# Altium project NORA_Clock_V0.2.PrjPcb
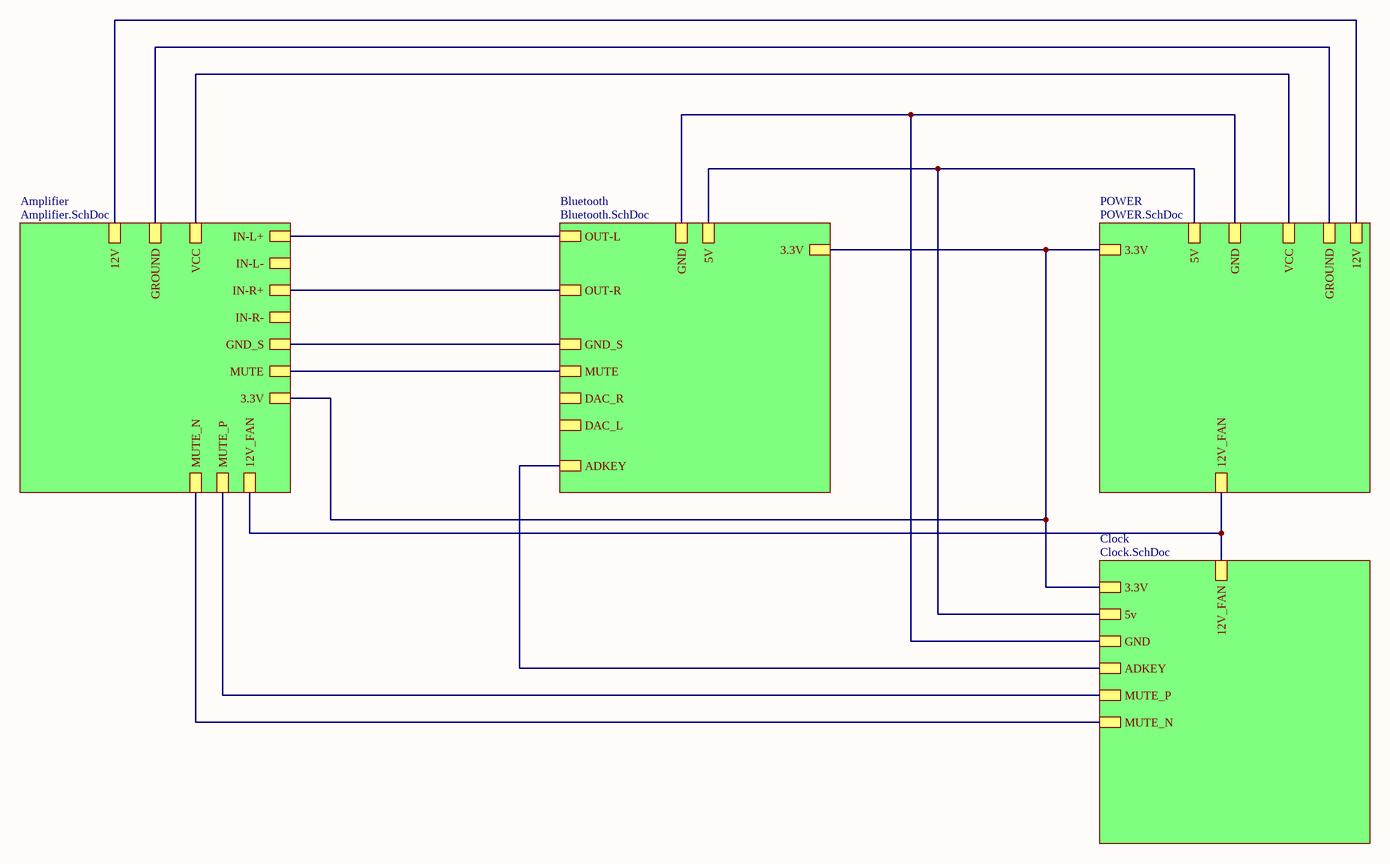
[diagram p0: NORA_Clock_V0.2.SchDoc]
5 sheets, 247 parts. Net scope: hierarchical (ports join the sheet entries above them; power ports are global).
Board files: NORA_Clock_V0.2-Pannel.PcbDoc, NORA_Clock_V0.2.PcbDoc
Sheets:
  NORA_Clock_V0.2.SchDoc
    Amplifier = Amplifier.SchDoc
    Bluetooth = Bluetooth.SchDoc
    POWER = POWER.SchDoc
    Clock = Clock.SchDoc

## Sheet NORA_Clock_V0.2.SchDoc
size A3; Value: 13nH

### Sub-sheets
Amplifier = Amplifier.SchDoc: IN-L+, IN-L-, IN-R+, IN-R-, MUTE, VCC, GROUND, GND_S, 3.3V, 12V, MUTE_P, MUTE_N, 12V_FAN
Bluetooth = Bluetooth.SchDoc: OUT-L, OUT-R, 3.3V, GND_S, GND, 5V, MUTE, DAC_R, DAC_L, ADKEY
Clock = Clock.SchDoc: ADKEY, 3.3V, 5v, GND, MUTE_N, MUTE_P, 12V_FAN
POWER = POWER.SchDoc: 3.3V, GND, 5V, VCC, GROUND, 12V, 12V_FAN

### Nets
3.3V: sheet Amplifier/3.3V, sheet Bluetooth/3.3V, sheet POWER/3.3V, sheet Clock/3.3V
12V: sheet Amplifier/12V, sheet POWER/12V
12V_FAN: sheet Amplifier/12V_FAN, sheet POWER/12V_FAN, sheet Clock/12V_FAN
AGND: sheet Amplifier/GND_S, sheet Bluetooth/GND_S
GND: sheet Amplifier/GROUND, sheet Bluetooth/GND, sheet POWER/GND, sheet POWER/GROUND, sheet Clock/GND
VCC: sheet Amplifier/VCC, sheet POWER/VCC
VPWR: sheet Bluetooth/5V, sheet POWER/5V, sheet Clock/5v
ADKEY: sheet Bluetooth/ADKEY, sheet Clock/ADKEY
CTRL: sheet Amplifier/MUTE_N, sheet Clock/MUTE_N
CTRL_P: sheet Amplifier/MUTE_P, sheet Clock/MUTE_P
DACL: sheet Amplifier/IN-L+, sheet Bluetooth/OUT-L
DACR: sheet Amplifier/IN-R+, sheet Bluetooth/OUT-R
MUTE: sheet Amplifier/MUTE, sheet Bluetooth/MUTE

### Notes on the sheet
- Title
- Size:
- Date:
- A3
- Number:
- Time:
- Revision:
- Sheet
- of
- File:

## Sheet Amplifier.SchDoc
size A2
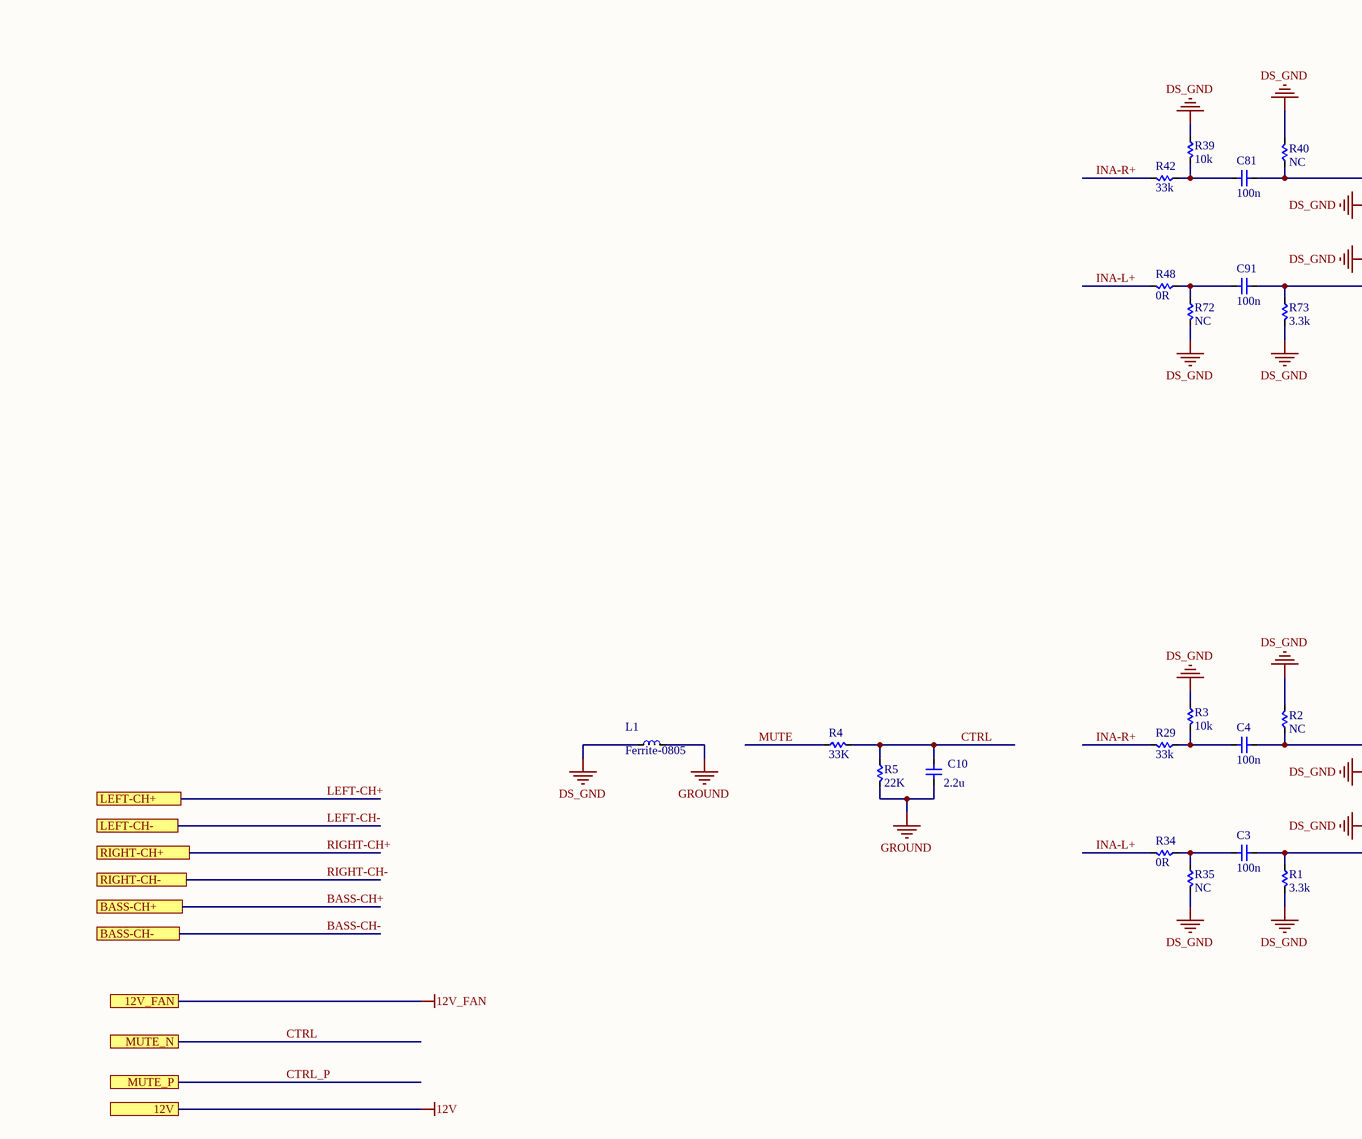
[diagram p1: Amplifier.SchDoc, top left]
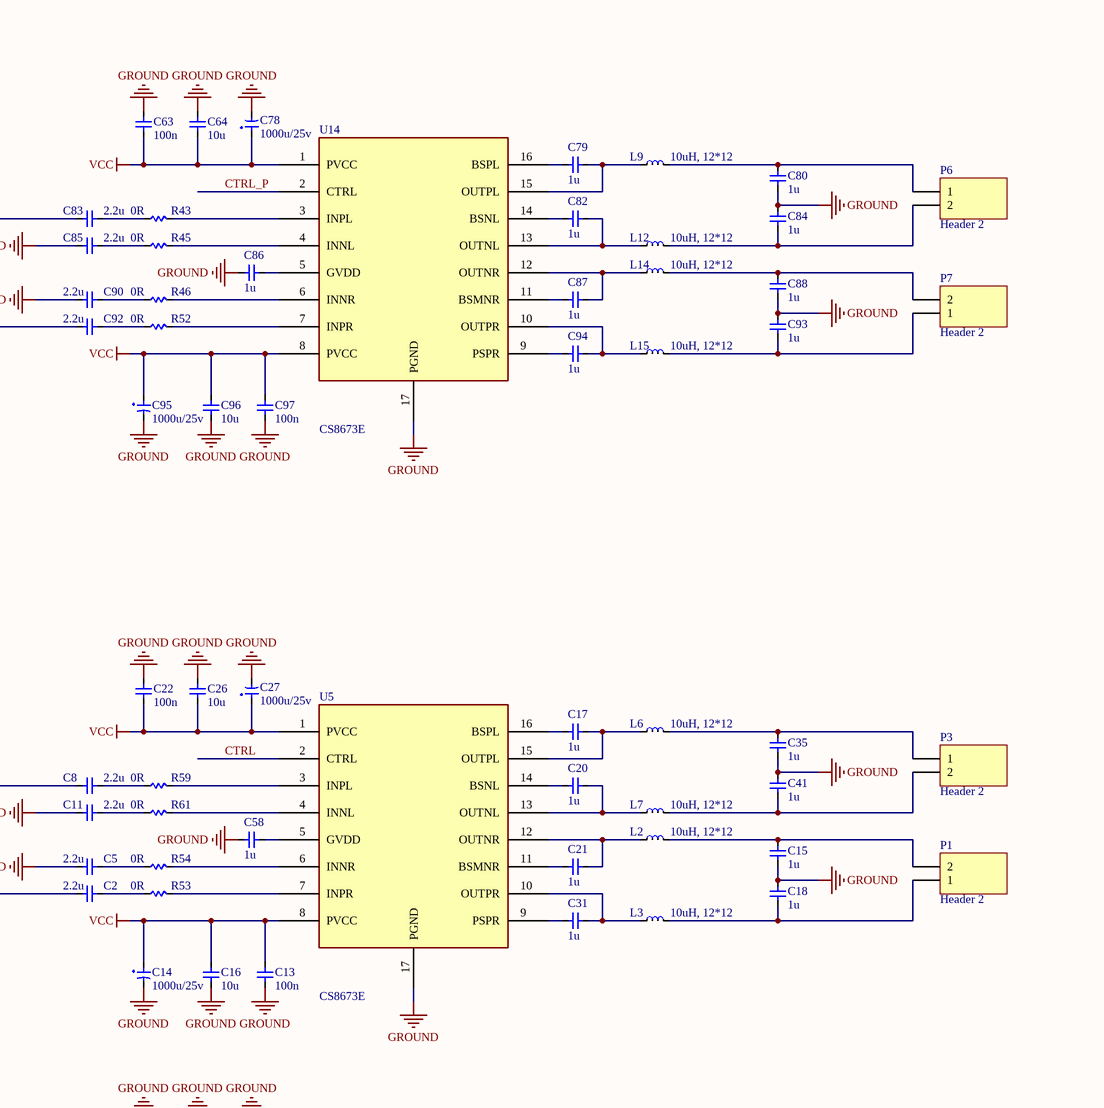
[diagram p2: Amplifier.SchDoc, top right]
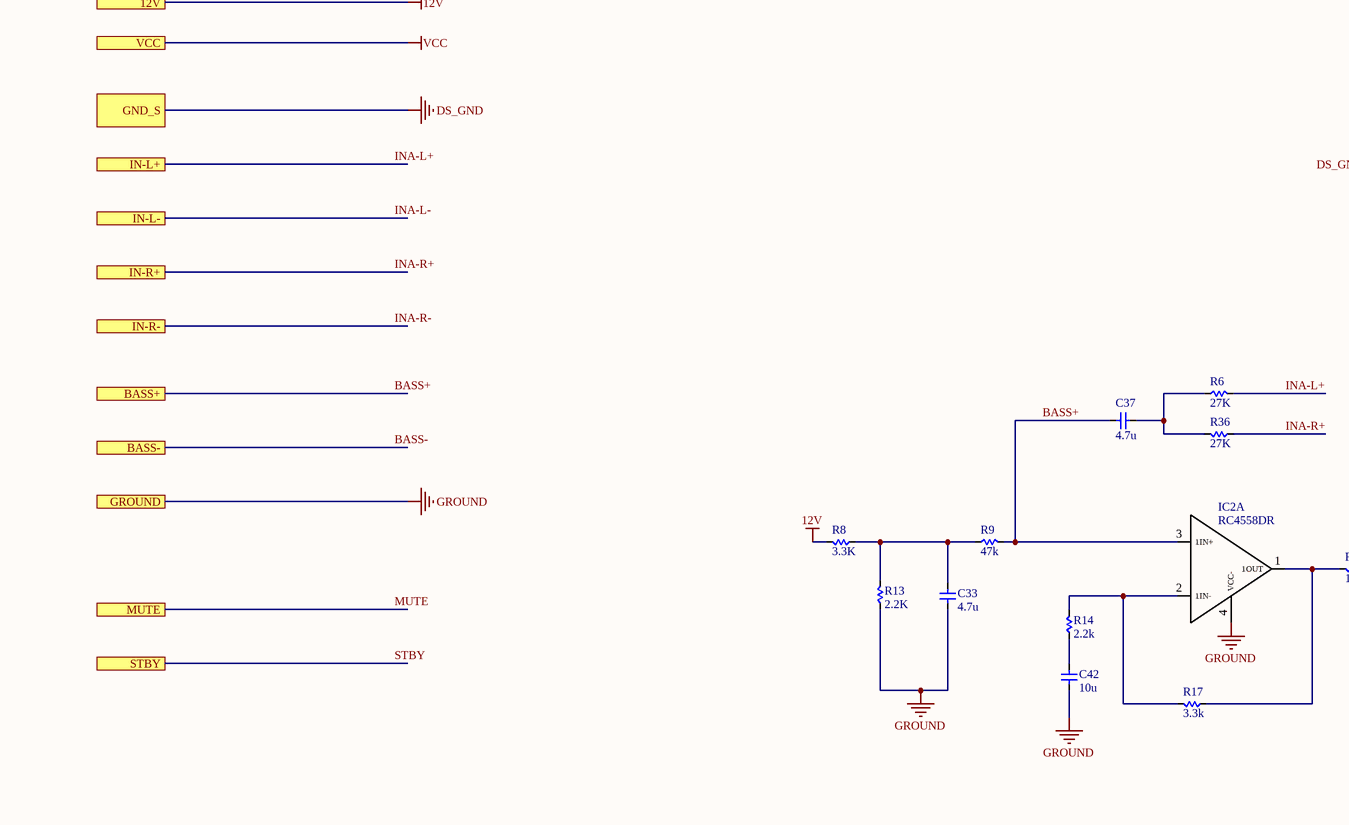
[diagram p3: Amplifier.SchDoc, bottom left]
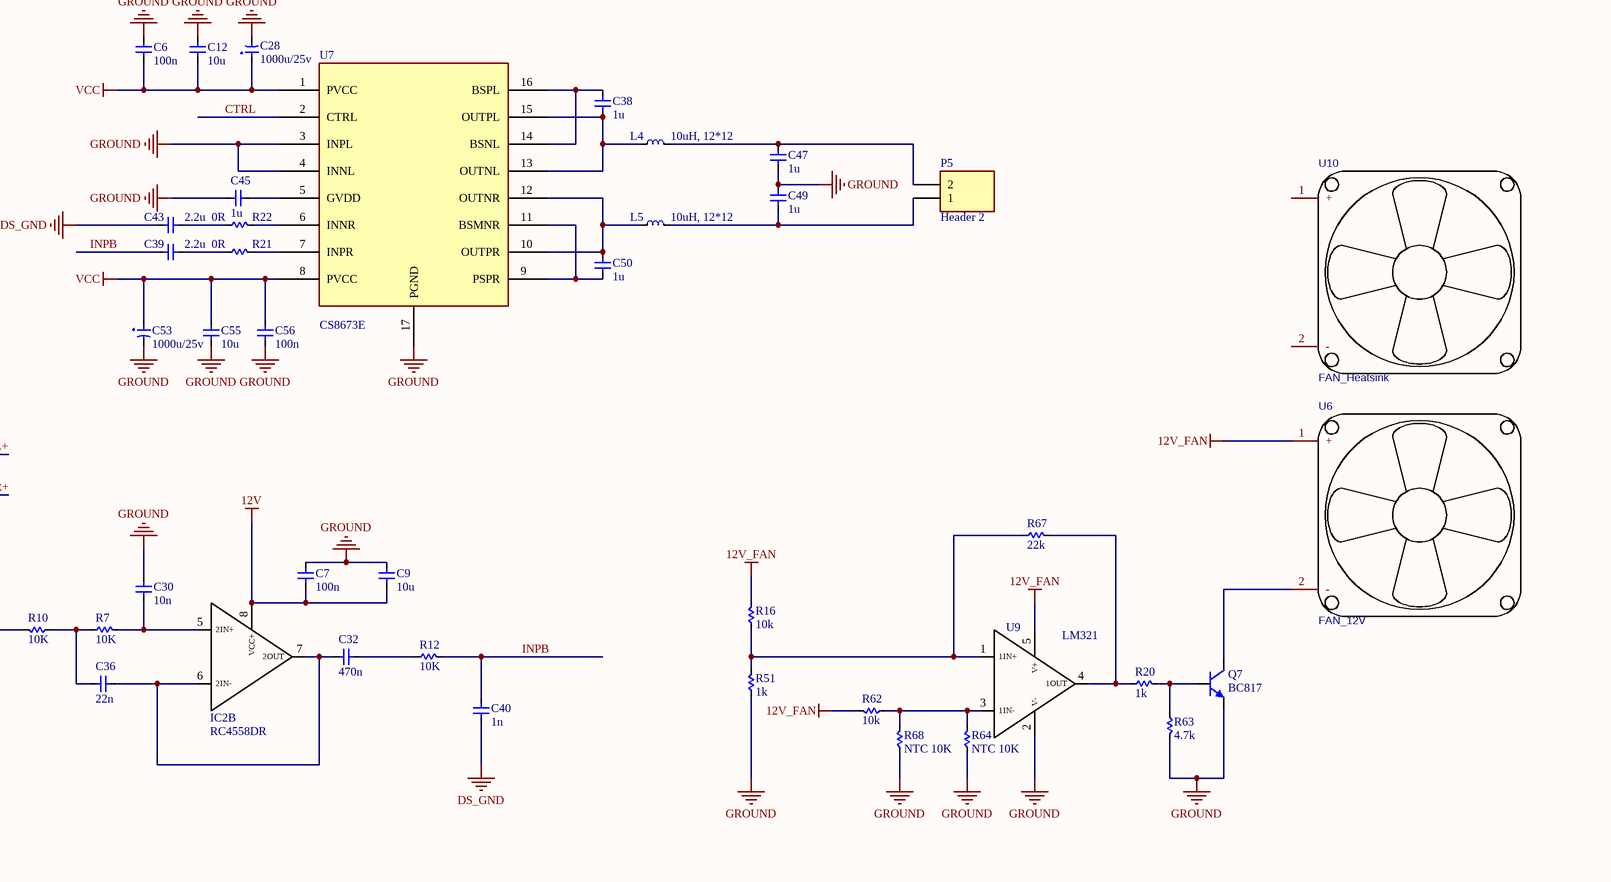
[diagram p4: Amplifier.SchDoc, bottom right]

### Parts
(Parts that share a designator on the sheet are numbered #1, #2 ... from top to bottom, then left to right.)
C2  2.2u  [cap0603]
C3  100n  [cap0603]
C4  100n  [cap0603]
C5  2.2u  [cap0603]
C6  100n  [cap0603]
C7  100n  [cap0603]
C8  2.2u  [cap0603]
C9  10u  [cap0603]
C10  2.2u  [cap0603]
C11  2.2u  [cap0603]
C12  10u  [CAP 0805]
C13  100n  [cap0603]
C14  1000u/25v  [CAP DIP 10*13]
C15  1u  [CAP 0805]
C16  10u  [CAP 0805]
C17  1u  [CAP 0805]
C18  1u  [CAP 0805]
C20  1u  [CAP 0805]
C21  1u  [CAP 0805]
C22  100n  [cap0603]
C26  10u  [CAP 0805]
C27  1000u/25v  [CAP DIP 10*13]
C28  1000u/25v  [CAP DIP 10*13]
C30  10n  [cap0603]
C31  1u  [CAP 0805]
C32  470n  [cap0603]
C33  4.7u  [cap0603]
C35  1u  [CAP 0805]
C36  22n  [cap0603]
C37  4.7u  [cap0603]
C38  1u  [CAP 0805]
C39  2.2u  [cap0603]
C40  1n  [cap0603]
C41  1u  [CAP 0805]
C42  10u  [CAP 1206]
C43  2.2u  [cap0603]
C45  1u  [cap0603]
C47  1u  [CAP 0805]
C49  1u  [CAP 0805]
C50  1u  [CAP 0805]
C53  1000u/25v  [CAP DIP 10*13]
C55  10u  [CAP 0805]
C56  100n  [cap0603]
C58  1u  [cap0603]
C63  100n  [cap0603]
C64#1  10u  [CAP 0805]
C78  1000u/25v  [CAP DIP 10*13]
C79  1u  [CAP 0805]
C80  1u  [CAP 0805]
C81  100n  [cap0603]
C82  1u  [CAP 0805]
C83  2.2u  [cap0603]
C84  1u  [CAP 0805]
C85  2.2u  [cap0603]
C86  1u  [cap0603]
C87  1u  [CAP 0805]
C88  1u  [CAP 0805]
C90  2.2u  [cap0603]
C91  100n  [cap0603]
C92  2.2u  [cap0603]
C93  1u  [CAP 0805]
C94  1u  [CAP 0805]
C95  1000u/25v  [CAP DIP 10*13]
C96  10u  [CAP 0805]
C97  100n  [cap0603]
IC2  RC4558DR  [RC4558]  (parts A,B of 2)
L1  Ferrite-0805  [Ferrite-0805]
L2  10uH, 12*12  [inductor 12*12]
L3  10uH, 12*12  [inductor 12*12]
L4  10uH, 12*12  [inductor 12*12]
L5  10uH, 12*12  [inductor 12*12]
L6  10uH, 12*12  [inductor 12*12]
L7  10uH, 12*12  [inductor 12*12]
L9  10uH, 12*12  [inductor 12*12]
L12  10uH, 12*12  [inductor 12*12]
L14  10uH, 12*12  [inductor 12*12]
L15  10uH, 12*12  [inductor 12*12]
P1  Header 2  [CONN-PHOENIX-5.08]
P3  Header 2  [CONN-PHOENIX-5.08]
P5  Header 2  [CONN-PHOENIX-3.81]
P6  Header 2  [CONN-PHOENIX-5.08]
P7  Header 2  [CONN-PHOENIX-5.08]
Q7  BC817  [BC817]
R1  3.3k  [RES-0603]
R2  NC  [RES-0603]
R3  10k  [RES-0603]
R4  33K  [RES-0603]
R5  22K  [RES-0603]
R6  27K  [RES-0603]
R7  10K  [RES-0603]
R8  3.3K  [RES-0603]
R9  47k  [RES-0603]
R10  10K  [RES-0603]
R12  10K  [RES-0603]
R13  2.2K  [RES-0603]
R14  2.2k  [RES-0603]
R16  10k  [RES-0603]
R17  3.3k  [RES-0603]
R20  1k  [RES-0603]
R21  0R  [RES-0603]
R22  0R  [RES-0603]
R29  33k  [RES-0603]
R34  0R  [RES-0603]
R35  NC  [RES-0603]
R36  27K  [RES-0603]
R39  10k  [RES-0603]
R40  NC  [RES-0603]
R42  33k  [RES-0603]
R43  0R  [RES-0603]
R45  0R  [RES-0603]
R46  0R  [RES-0603]
R48  0R  [RES-0603]
R51  1k  [RES-0603]
R52  0R  [RES-0603]
R53  0R  [RES-0603]
R54  0R  [RES-0603]
R59  0R  [RES-0603]
R61  0R  [RES-0603]
R62  10k  [RES-0603]
R63  4.7k  [RES-0603]
R64  NTC 10K  [RES-0805]
R67  22k  [RES-0603]
R68  NTC 10K  [RES-0805]
R72  NC  [RES-0603]
R73  3.3k  [RES-0603]
U5  CS8673E  [CS8673E]
U6  FAN_12V  [FAN_Connector XH]
U7  CS8673E  [CS8673E]
U9  LM321  [LM321]
U10  FAN_Heatsink  [FAN_Heatsink]
U14  CS8673E  [CS8673E]

### Ports
12V, 12V_FAN, BASS+, BASS-, BASS-CH+, BASS-CH-, GND_S, GROUND, IN-L+, IN-L-, IN-R+, IN-R-, LEFT-CH+, LEFT-CH-, MUTE, MUTE_N, MUTE_P, RIGHT-CH+, RIGHT-CH-, STBY, VCC

### Nets
12V: C7.2 C9.1 IC2.8(VCC+) R8.2 ; port 12V
12V_FAN: R16.2 R62.2 U6.1(+) U9.5(V+) ; port 12V_FAN
DS_GND: C5.2 C11.2 C40.1 C43.2 C85.2 C90.2 L1.2 R1.2 R2.2 R3.1 R35.2 R39.1 R40.2 R72.2 R73.2 ; port GND_S  [project net AGND]
GROUND: C6.2 C7.1 C9.2 C10.1 C12.1 C13.2 C14.2(NEG) C15.1 C16.1 C18.2 C22.2 C26.1 C27.2(NEG) C28.2(NEG) C30.1 C33.1 C35.1 C41.2 C42.1 C45.1 C47.1 C49.2 C53.2(NEG) C55.1 C56.2 C58.1 C63.2 C64#1.1 C78.2(NEG) C80.1 C84.2 C86.1 C88.1 C93.2 C95.2(NEG) C96.1 C97.2 IC2.4(VCC-) L1.1 Q7.2(E) R5.2 R13.1 R51.1 R63.2 R64.1 R68.1 U5.17(PGND) U7.3(INPL) U7.4(INNL) U7.17(PGND) U9.2(V-) U14.17(PGND) ; port GROUND  [project net GND]
VCC: C6.1 C12.2 C13.1 C14.1(POS) C16.2 C22.1 C26.2 C27.1(POS) C28.1(POS) C53.1(POS) C55.2 C56.1 C63.1 C64#1.2 C78.1(POS) C95.1(POS) C96.2 C97.1 U5.1(PVCC) U5.8(PVCC) U7.1(PVCC) U7.8(PVCC) U14.1(PVCC) U14.8(PVCC) ; port VCC
BASS+: C37.1 IC2.3(1IN+) R9.2 ; port BASS+
BASS-: port BASS-
BASS-CH+: port BASS-CH+
BASS-CH-: port BASS-CH-
CTRL: C10.2 R4.2 R5.1 U5.2(CTRL) U7.2(CTRL) ; port MUTE_N
CTRL_P: U14.2(CTRL) ; port MUTE_P
INA-L+: R6.2 R34.2 R48.2 ; port IN-L+  [project net DACL]
INA-L-: port IN-L-
INA-R+: R29.2 R36.1 R42.2 ; port IN-R+  [project net DACR]
INA-R-: port IN-R-
INPB: C39.2 C40.2 R12.2
LEFT-CH+: port LEFT-CH+
LEFT-CH-: port LEFT-CH-
MUTE: R4.1 ; port MUTE
RIGHT-CH+: port RIGHT-CH+
RIGHT-CH-: port RIGHT-CH-
STBY: port STBY
NetC2_1: C2.1 C3.1 R1.1
NetC2_2: C2.2 R53.1
NetC3_2: C3.2 R34.1 R35.1
NetC4_1: C4.1 C8.2 R2.1
NetC4_2: C4.2 R3.2 R29.1
NetC5_1: C5.1 R54.1
NetC8_1: C8.1 R59.1
NetC11_1: C11.1 R61.1
NetC15_2: C15.2 L2.1 P1.2
NetC17_1: C17.1 L6.2 U5.15(OUTPL)
NetC17_2: C17.2 U5.16(BSPL)
NetC18_1: C18.1 L3.1 P1.1
NetC20_1: C20.1 L7.2 U5.13(OUTNL)
NetC20_2: C20.2 U5.14(BSNL)
NetC21_1: C21.1 L2.2 U5.12(OUTNR)
NetC21_2: C21.2 U5.11(BSMNR)
NetC30_2: C30.2 IC2.5(2IN+) R7.2
NetC31_1: C31.1 L3.2 U5.10(OUTPR)
NetC31_2: C31.2 U5.9(PSPR)
NetC32_1: C32.1 C36.1 IC2.6(2IN-) IC2.7(2OUT)
NetC32_2: C32.2 R12.1
NetC33_2: C33.2 R8.1 R9.1 R13.2
NetC35_2: C35.2 L6.1 P3.1
NetC36_2: C36.2 R7.1 R10.1
NetC37_2: C37.2 R6.1 R36.2
NetC38_1: C38.1 L4.2 U7.13(OUTNL) U7.15(OUTPL)
NetC38_2: C38.2 U7.14(BSNL) U7.16(BSPL)
NetC39_1: C39.1 R21.1
NetC41_1: C41.1 L7.1 P3.2
NetC42_2: C42.2 R14.1
NetC43_1: C43.1 R22.1
NetC45_2: C45.2 U7.5(GVDD)
NetC47_2: C47.2 L4.1 P5.2
NetC49_1: C49.1 L5.1 P5.1
NetC50_1: C50.1 L5.2 U7.10(OUTPR) U7.12(OUTNR)
NetC50_2: C50.2 U7.9(PSPR) U7.11(BSMNR)
NetC58_2: C58.2 U5.5(GVDD)
NetC79_1: C79.1 L9.2 U14.15(OUTPL)
NetC79_2: C79.2 U14.16(BSPL)
NetC80_2: C80.2 L9.1 P6.1
NetC81_1: C81.1 C83.2 R40.1
NetC81_2: C81.2 R39.2 R42.1
NetC82_1: C82.1 L12.2 U14.13(OUTNL)
NetC82_2: C82.2 U14.14(BSNL)
NetC83_1: C83.1 R43.1
NetC84_1: C84.1 L12.1 P6.2
NetC85_1: C85.1 R45.1
NetC86_2: C86.2 U14.5(GVDD)
NetC87_1: C87.1 L14.2 U14.12(OUTNR)
NetC87_2: C87.2 U14.11(BSMNR)
NetC88_2: C88.2 L14.1 P7.2
NetC90_1: C90.1 R46.1
NetC91_1: C91.1 C92.1 R73.1
NetC91_2: C91.2 R48.1 R72.1
NetC92_2: C92.2 R52.1
NetC93_1: C93.1 L15.1 P7.1
NetC94_1: C94.1 L15.2 U14.10(OUTPR)
NetC94_2: C94.2 U14.9(PSPR)
NetIC2_1: IC2.1(1OUT) R10.2 R17.1
NetIC2_2: IC2.2(1IN-) R14.2 R17.2
NetQ7_1: Q7.1(B) R20.2 R63.1
NetQ7_3: Q7.3(C) U6.2(-)
NetR16_1: R16.1 R51.2 R67.1 U9.1(1IN+)
NetR20_1: R20.1 R67.2 U9.4(1OUT)
NetR21_2: R21.2 U7.7(INPR)
NetR22_2: R22.2 U7.6(INNR)
NetR43_2: R43.2 U14.3(INPL)
NetR45_2: R45.2 U14.4(INNL)
NetR46_2: R46.2 U14.6(INNR)
NetR52_2: R52.2 U14.7(INPR)
NetR53_2: R53.2 U5.7(INPR)
NetR54_2: R54.2 U5.6(INNR)
NetR59_2: R59.2 U5.3(INPL)
NetR61_2: R61.2 U5.4(INNL)
NetR62_1: R62.1 R64.2 R68.2 U9.3(1IN-)

Not connected (* = marked no-connect by the designer): U10 1(+) 2(-)

### Notes on the sheet
- Title
- Size:
- Date:
- File:
- A1
- Number:
- Time:
- Revision:
- Sheet
- of

### Library data of the parts
C2 C5-C8 C11 C13 C22 C30 C32 C36 C39 C40 C43 C45 C56 C58 C63 C83 C85 C86 C90 C92 C97 = Cap 0603: Capacitor 0603; Published: 8-Jun-2000; LatestRevisionDate: 17-Jul-2002; LatestRevisionNote: Re-released for DXP Platform.; Publisher: Altium Limited; Value: *
C3 C4 C9 C10 C33 C37 C81 C91 = Cap 0603: Capacitor 0603; Value: 104; Published: 8-Jun-2000; LatestRevisionDate: 17-Jul-2002; LatestRevisionNote: Re-released for DXP Platform.; Publisher: Altium Limited
C12 C15-C18 C20 C21 C26 C31 C35 C38 C41 C47 C49 C50 C55 C64#1 C79 C80 C82 C84 C87 C88 C93 C94 C96 = Cap 0805: Capacitor 0805; Value: 104; Published: 8-Jun-2000; LatestRevisionDate: 17-Jul-2002; LatestRevisionNote: Re-released for DXP Platform.; Publisher: Altium Limited
C14 C27 C28 C53 C78 C95 = capacitor dip 10*13: 2200ÂµF 50V Aluminum Electrolytic Capacitors Radial, Can 1000 Hrs @ 105Â°C; MF: Nichicon; MP: UVZ1H222MHD; Package: Radial Nichicon; Value: *; Price: None; SnapEDA_Link: https://www.snapeda.com/parts/UVZ1H222MHD/Nichicon/view-part/468437/?ref=snap; Availability: Unavailable
C42 = Cap 1206: Capacitor 1206; Value: 104; Published: 8-Jun-2000; LatestRevisionDate: 17-Jul-2002; LatestRevisionNote: Re-released for DXP Platform.; Publisher: Altium Limited
IC2 = RC4558DR: Integrated Circuit SOIC 8; Manufacturer_Name: Texas Instruments; Datasheet Link: http://www.ti.com/lit/gpn/rc4558; Height: 1.75mm; Manufacturer_Part_Number: RC4558DR; Arrow Part Number: RC4558DR; Arrow Price/Stock: https://www.arrow.com/en/products/rc4558dr/texas-instruments; Mouser Part Number: 595-RC4558DR; Mouser Price/Stock: https://www.mouser.co.uk/ProductDetail/Texas-Instruments/RC4558DR?qs=DXdcjUGny5OhrzskaZRdew%3D%3D
L1 = Ferrite _0805: BLM Series 0805 330 Ohm 400 mA 0.58 Ohm DCR Surface Mount Ferrite Bead; MF: Murata; MP: BLM18BB331SN1D; Package: 0603 Murata; Price: None; Availability: Unavailable; SnapEDA_Link: https://www.snapeda.com/parts/BLM18BB331SN1D/Murata%20Electronics%20North%20America/view-part/?ref=snap; Value: *
L2-L7 L9 L12 L14 L15 = INDUCTOR 12*12: Inductor round 12*12; MP: DR127-330-R; MF: Eaton; Price: None; Package: Nonstandard Eaton; Availability: Unavailable; SnapEDA_Link: https://www.snapeda.com/parts/DR127-330-R/Eaton/view-part/?ref=snap; Value: *
P1 P3 P6 P7 = CONN-Phoenix-5.08: Phoenix Connector 5.08; LatestRevisionDate: 17-Jul-2002; LatestRevisionNote: Re-released for DXP Platform.; Publisher: Altium Limited
P5 = CONN-Phoenix-3.81_1: Phoenix Connector 3.81; LatestRevisionDate: 17-Jul-2002; LatestRevisionNote: Re-released for DXP Platform.; Publisher: Altium Limited
Q7 = BC817: NPN General Purpose Amplifier BJT; Published: 8-Jun-2000; LatestRevisionDate: 15-Jan-2003; LatestRevisionNote: PCB Footprint 'BCY-W3/D4.7' replaced; DatasheetVersion: 1997; PackageVersion: Sep-1998; PackageReference: TO-92A; Publisher: Altium Limited; PackageDescription: TO, Flat Index; 3 In-Line, Axial Leads; Body Dia. 4.5mm; Leads 0.51 x 0.48 mm (max); ComponentLink1Description: Manufacturer Link; ComponentLink1URL: http://www.fairchildsemi.com/; ComponentLink2Description: Datasheet; ComponentLink2URL: http://www.fairchildsemi.com/ds/2N%2F2N3904.pdf
R1 R4-R10 R12-R14 R16 R17 R20-R22 R36 R43 R45 R46 R51-R54 R59 R61-R63 R67 R73 = Res 0603: Resistor 0603; Published: 8-Jun-2000; LatestRevisionDate: 29-May-2009; LatestRevisionNote: IPC-7351 Footprint Added.; PackageReference: J1-0603; Publisher: Altium Limited; PackageDescription: Chip Resistor
  R1 R73: Value: 3.3k
  R4-R10 R12-R14 R17 R36: Value: *
R2 R3 R29 R34 R35 R39 R40 R42 R48 R72 = Res 0603: Resistor 0603; Value: 3.3k; Published: 8-Jun-2000; LatestRevisionDate: 29-May-2009; LatestRevisionNote: IPC-7351 Footprint Added.; PackageReference: J1-0603; Publisher: Altium Limited; PackageDescription: Chip Resistor
R64 R68 = Res 0805: resistor 0805
U5 U7 U14 = CS8673E: AB/D 2X40W BTL & 80W PBTL ESOP16; Manufacturer_Name: Chipstar; Manufacturer_Part_Number: CS8679E; Height: 2.47mm; Arrow Part Number: CS8679E; Arrow Price/Stock: https://www.arrow.com/en/products/tda7491hv13tr/stmicroelectronics; Mouser Part Number: 511-TDA7491HV13TR; Mouser Price/Stock: https://www.mouser.com/Search/Refine.aspx?Keyword=511-TDA7491HV13TR
U6 = FAN_12V: FAN 12V 40*40*10mm . XH Connector; Contributor: novasilisko; timeStamp: 1467237407; Manufacturer Part: ?; spicePre: U
U9 = LM321: Operational Amplifier 5-SOT-23; MP: OPA354AIDBVT; MF: Texas Instruments; Package: SOT-23-5 Texas Instruments; Digi-Key_Purchase_URL: https://www.digikey.de/product-detail/en/texas-instruments/OPA354AIDBVT/296-13033-1-ND/480149?utm_source=snapeda&utm_medium=aggregator&utm_campaign=symbol; SnapEDA_Link: https://www.snapeda.com/parts/OPA354AIDBVT/Texas%20Instruments/view-part/?ref=snap; Digi-Key_Part_Number: 296-13033-1-ND; Value: *
U10 = FAN_Heatsink: 55mm Aluminum Heatsink with Cooling Fan; Contributor: novasilisko; timeStamp: 1467237407; Manufacturer Part: ?; spicePre: U

## Sheet Bluetooth.SchDoc
size A3 portrait
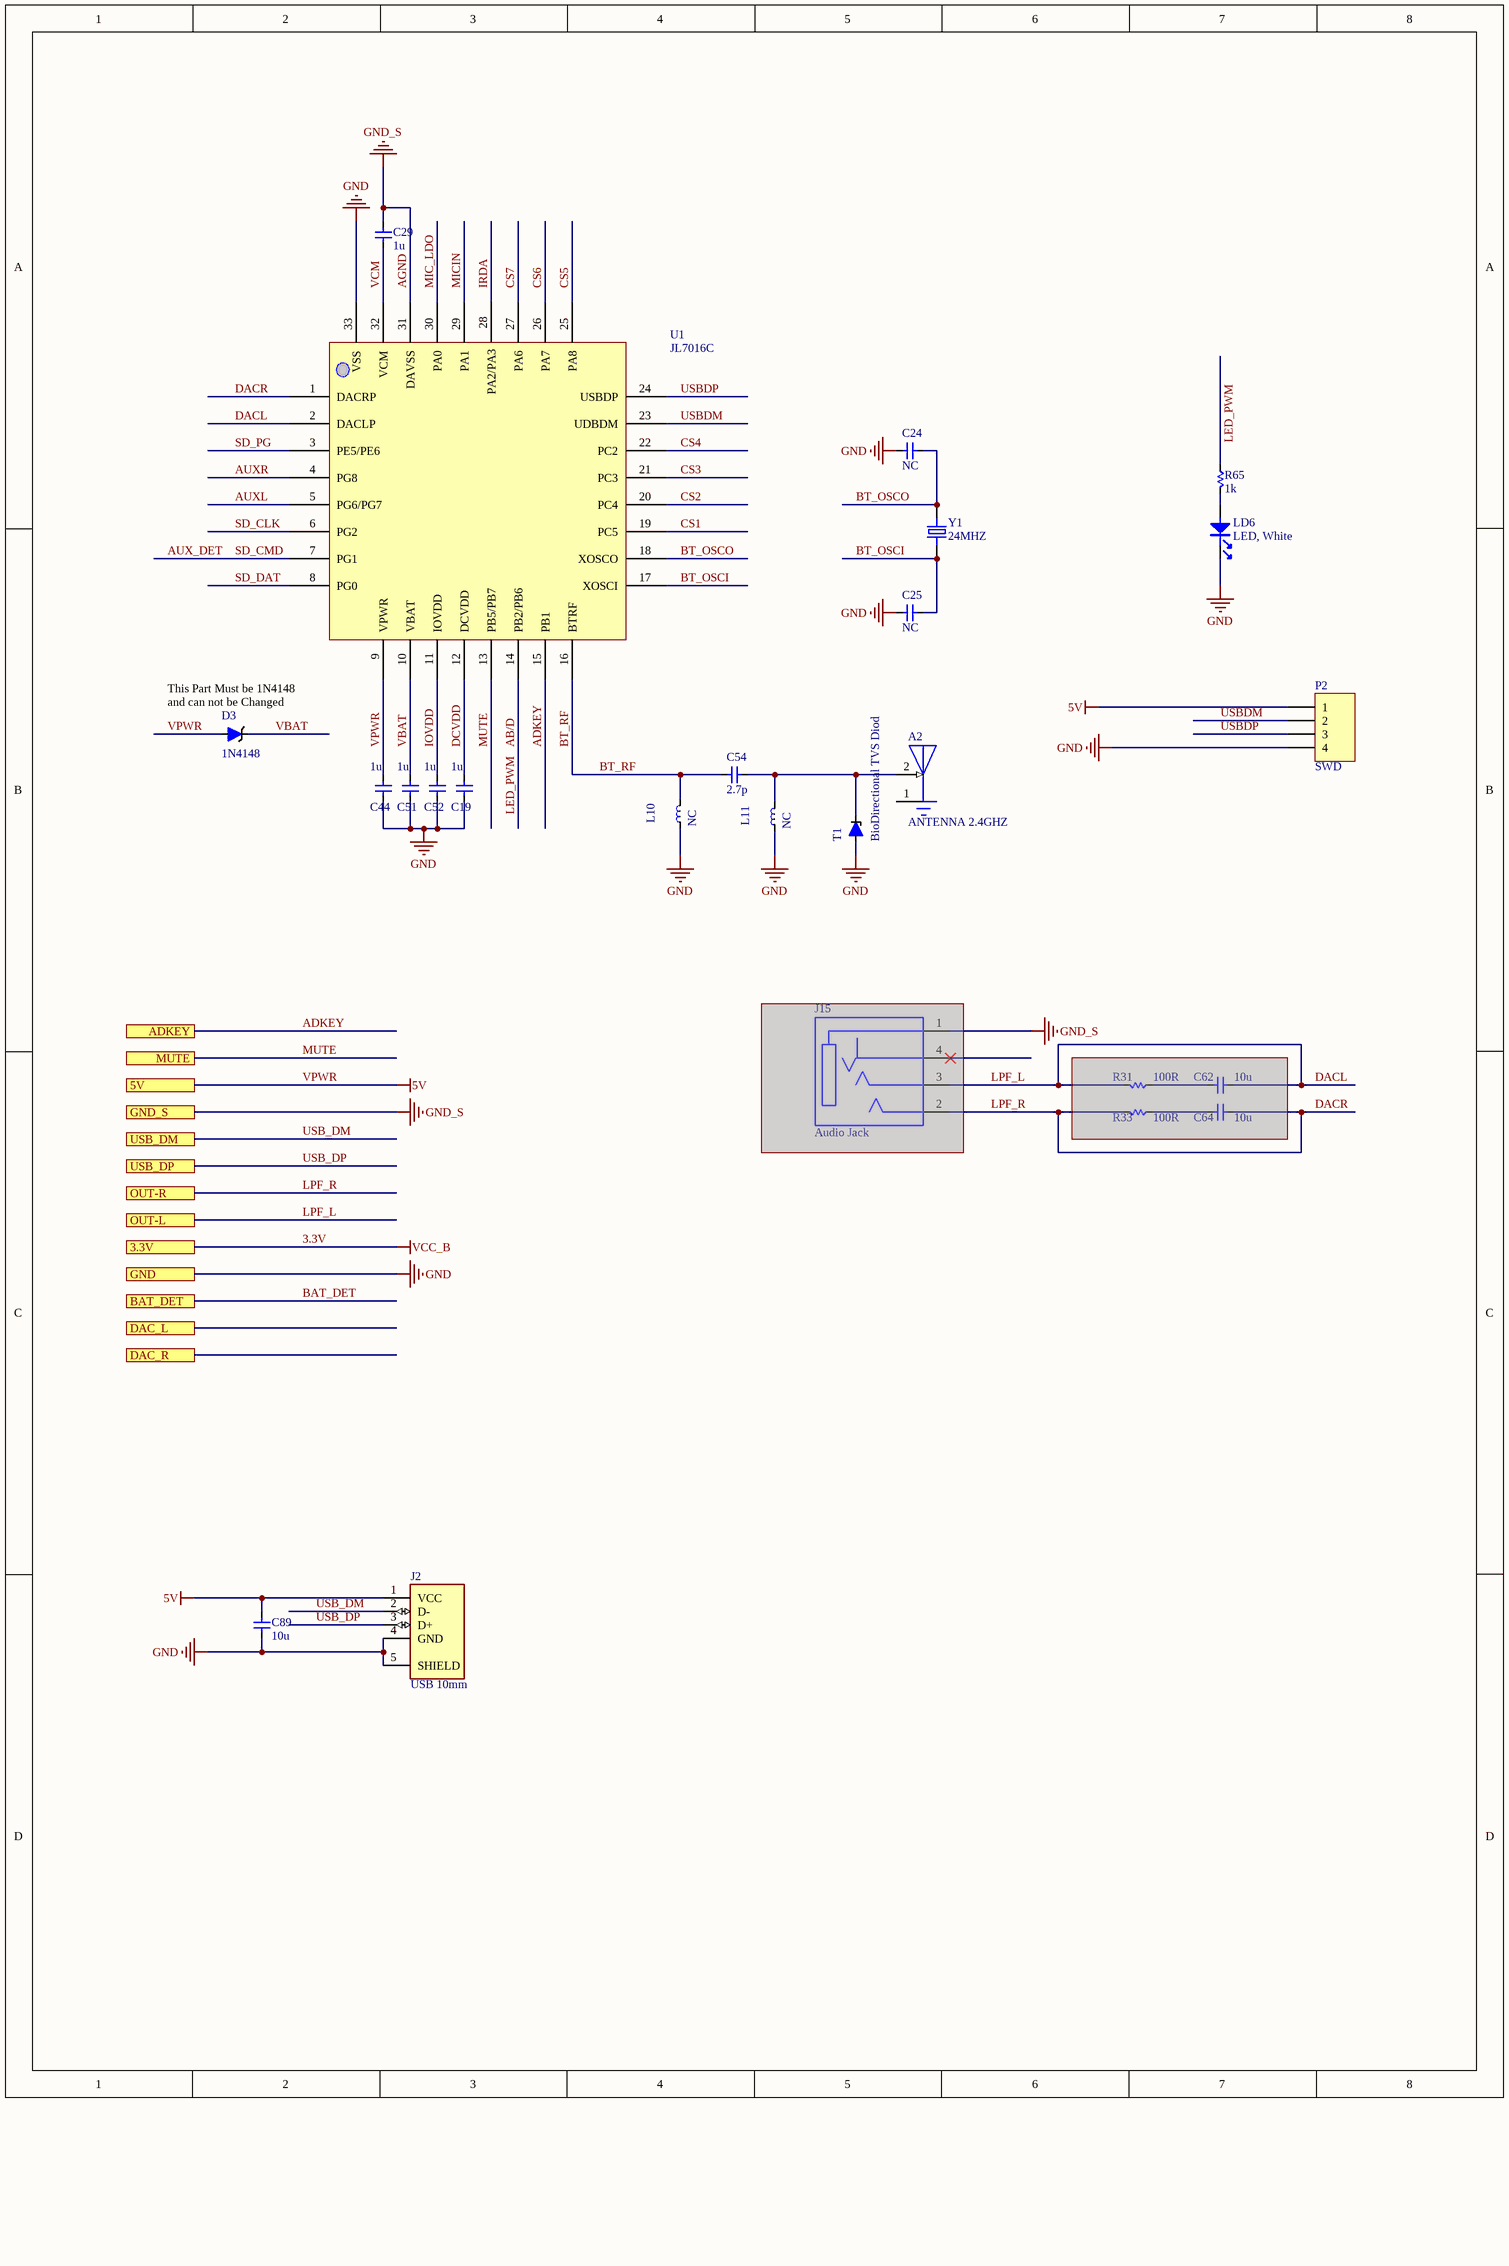
[diagram p5: Bluetooth.SchDoc]

### Parts
(Parts that share a designator on the sheet are numbered #1, #2 ... from top to bottom, then left to right.)
A2  ANTENNA 2.4GHZ  [ANTENNA 2.4GHZ - TI]
C19  1u  [cap0603]
C24  NC  [cap0603]
C25  NC  [cap0603]
C29  1u  [cap0603]
C44  1u  [cap0603]
C51  1u  [cap0603]
C52  1u  [cap0603]
C54  2.7p  [cap0603]
C62#1  10u  [CAP 0805]  (masked out: inside a compile mask, not in the netlist)
C64#2  10u  [CAP 0805]  (masked out: inside a compile mask, not in the netlist)
C89  10u  [CAP 0805]
D3  1N4148  [1N4148 SOD-123]
J2  USB 10mm  [USB SMALL]
J15  Audio Jack  [Audio jack_ CUI_SJ2-3574A-SMT-TR]  (masked out: inside a compile mask, not in the netlist)
L10  NC  [inductor 0603]
L11  NC  [inductor 0603]
LD6  LED, White  [LED-0603-BLUE]
P2  SWD  [HDR1X4H]
R31#1  100R  [RES-0603]  (masked out: inside a compile mask, not in the netlist)
R33#1  100R  [RES-0603]  (masked out: inside a compile mask, not in the netlist)
R65  1k  [RES-0603]
T1  BioDirectional TVS Diod  [SMAJ3.3A]
U1  JL7016C  [JL7016C]
Y1  24MHZ  [crystal b]

### Ports
3.3V, 5V, ADKEY, BAT_DET, DAC_L, DAC_R, GND, GND_S, MUTE, OUT-L, OUT-R, USB_DM, USB_DP

### Nets
AGND: C29.2 U1.31(DAVSS) ; port GND_S  [also labelled GND_S]
GND: C19.2 C24.1 C25.2 C44.2 C51.2 C52.2 C89.1 J2.4(GND) J2.5(SHIELD) L10.2 L11.2 LD6.1 P2.4 T1.A U1.33(VSS) ; port GND
VPWR: C44.1 C89.2 D3.1(A) J2.1(VCC) P2.1 U1.9(VPWR) ; port 5V  [also labelled 5V]
AB/D: R65.1 U1.14(PB2/PB6)  [also labelled LED_PWM]
ADKEY: U1.15(PB1) ; port ADKEY
AUX_DET: U1.7(PG1)  [also labelled SD_CMD]
AUXL: U1.5(PG6/PG7)
AUXR: U1.4(PG8)
BAT_DET: port BAT_DET
BT_OSCI: C25.1 U1.17(XOSCI) Y1.1
BT_OSCO: C24.2 U1.18(XOSCO) Y1.2
BT_RF: C54.2 L10.1 U1.16(BTRF)
CS1: U1.19(PC5)
CS2: U1.20(PC4)
CS3: U1.21(PC3)
CS4: U1.22(PC2)
CS5: U1.25(PA8)
CS6: U1.26(PA7)
CS7: U1.27(PA6)
DACL: U1.2(DACLP) ; port OUT-L  [also labelled LPF_L]
DACR: U1.1(DACRP) ; port OUT-R  [also labelled LPF_R]
DCVDD: C19.1 U1.12(DCVDD)
IOVDD: C52.1 U1.11(IOVDD)
IRDA: U1.28(PA2/PA3)
MIC_LDO: U1.30(PA0)
MICIN: U1.29(PA1)
MUTE: U1.13(PB5/PB7) ; port MUTE
SD_CLK: U1.6(PG2)
SD_DAT: U1.8(PG0)
SD_PG: U1.3(PE5/PE6)
USB_DM: J2.2(D-) ; port USB_DM
USB_DP: J2.3(D+) ; port USB_DP
USBDM: P2.2 U1.23(UDBDM)
USBDP: P2.3 U1.24(USBDP)
VBAT: C51.1 D3.2(C) U1.10(VBAT)
VCM: C29.1 U1.32(VCM)
NetA2_2: A2.2(FEED) C54.1 L11.1 T1.C
NetLD6_2: LD6.2 R65.2

Not connected (* = marked no-connect by the designer): A2 1(GND)

### Notes on the sheet
- (near D3) This Part Must be 1N4148 and can not be Changed
- Title
- Size:
- Date:
- File:
- A2
- Number:
- Time:
- Revision:
- Sheet
- of

### Library data of the parts
A2 = ANTENNA 2.4GHZ: ESP32 ANTENNA; MP: PRO-OB-440; MF: Proant AB; SnapEDA_Link: https://www.snapeda.com/parts/PRO-OB-440/Proant%20AB/view-part/2307534/?ref=snap; Digi-Key_Purchase_URL: https://www.digikey.com/product-detail/en/proant-ab/PRO-OB-440/1532-1001-1-ND/4895684?utm_source=snapeda&utm_medium=aggregator&utm_campaign=symbol; Value: *; Package: None; Digi-Key_Part_Number: 1532-1001-1-ND
C19 C24 C25 C29 C44 C51 C52 C54 = Cap 0603: Capacitor 0603; Value: 104; Published: 8-Jun-2000; LatestRevisionDate: 17-Jul-2002; LatestRevisionNote: Re-released for DXP Platform.; Publisher: Altium Limited
C62#1 C64#2 C89 = Cap 0805: Capacitor 0805; Value: 104; Published: 8-Jun-2000; LatestRevisionDate: 17-Jul-2002; LatestRevisionNote: Re-released for DXP Platform.; Publisher: Altium Limited
D3 = 1N4148_SOD123: SOD-123 Package; MP: EDZV12B; MF: ROHM Semiconductor; Price: None; Package: None; SnapEDA_Link: https://www.snapeda.com/parts/EDZV12B/EMI/view-part/4479349/?ref=snap; Availability: Unavailable; Value: *
J2 = usb a small: UJ2-AV-1-SMT usb a vertical  small; MF: {'manufacturer': u'CUI Devices'}; Package: None; Value: *; Availability: Unavailable; MP: UJ2-AV-1-SMT; Price: None
J15 = Audio Jack _ SJ2-3574A-SMT-TR: 3.5 mm, Stereo, Right Angle, Surface Mount _SMT_, Audio Jack Connector; MF: CUI Devices; Package: None; Value: *; Availability: Unavailable; SnapEDA_Link: https://www.snapeda.com/parts/SJ2-3574A-SMT-TR/CUI%20Devices/view-part/648175/?ref=snap; Price: None; MP: SJ2-3574A-SMT-TR
L10 L11 = INDUCTOR_SMD: Inductor smd; MP: DR127-330-R; MF: Eaton; Price: None; Package: Nonstandard Eaton; Availability: Unavailable; SnapEDA_Link: https://www.snapeda.com/parts/DR127-330-R/Eaton/view-part/?ref=snap; Value: *
LD6 = LED_blue: LED, Blue, 0603; Manuf_1: everlight; Manuf_Part_1: 19-213-R6C-AP1Q2B/3T; ECCN_US/EU: EAR99/NEC; Order: 19-213-R6C-AP1Q2B/3T
P2 = Header 4: Header, 4-Pin; LatestRevisionDate: 17-Jul-2002; LatestRevisionNote: Re-released for DXP Platform.; Publisher: Altium Limited
R31#1 R33#1 R65 = Res 0603: Resistor 0603; Published: 8-Jun-2000; LatestRevisionDate: 29-May-2009; LatestRevisionNote: IPC-7351 Footprint Added.; PackageReference: J1-0603; Publisher: Altium Limited; PackageDescription: Chip Resistor
  R31#1 R33#1: Value: *
T1 = SMAJ3.3A: one side TVS Diode; MP: EDZV12B; MF: ROHM Semiconductor; Price: None; Package: None; SnapEDA_Link: https://www.snapeda.com/parts/EDZV12B/EMI/view-part/4479349/?ref=snap; Availability: Unavailable; Value: *
U1 = JL7016C: BlE Chip
Y1 = crystal b: 13MHz Â±30ppm Crystal 20pF 60 Ohms HC-49/US  ECS-130-20-3X-TR; MF: ECS Inc.; Value: *; SnapEDA_Link: https://www.snapeda.com/parts/ECS-130-20-3X-TR/ECS%20Inc./view-part/2459108/?ref=snap; MP: ECS-130-20-3X-TR; Check_prices: https://www.snapeda.com/parts/ECS-130-20-3X-TR/ECS%20Inc./view-part/2459108/?ref=eda; Purchase-URL: https://pricing.snapeda.com/search/part/ECS-130-20-3X-TR/?ref=eda; Availability: Warning; Price: None; Package: HC49/US ECS International

## Sheet POWER.SchDoc
size A3
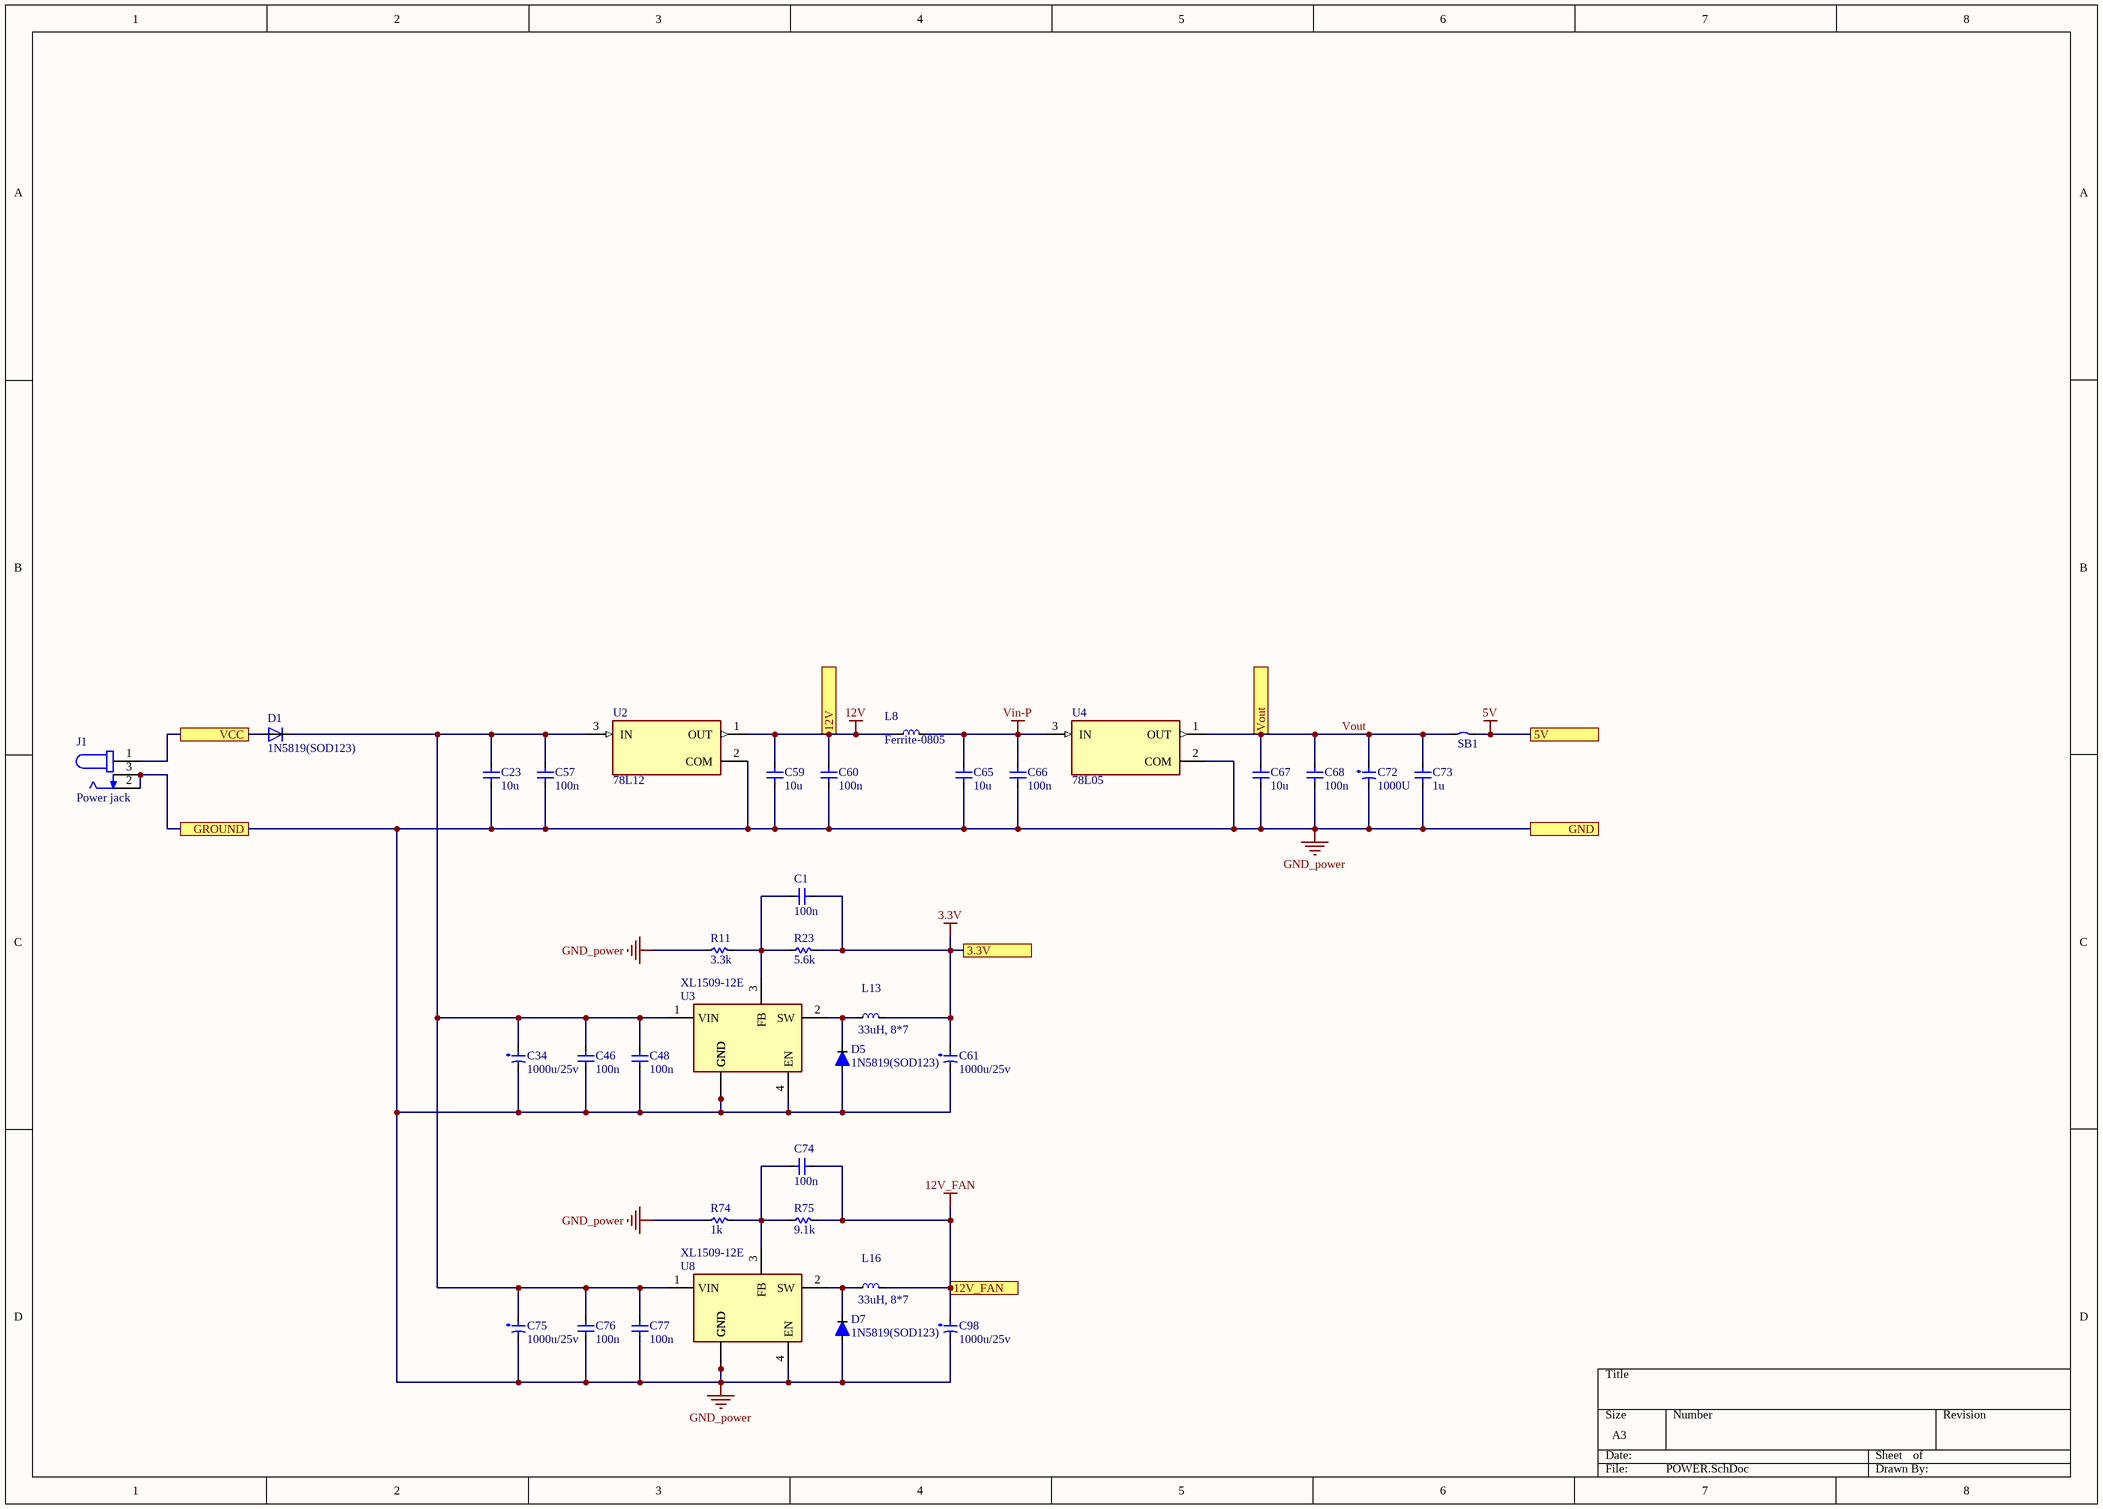
[diagram p6: POWER.SchDoc]

### Parts
C1  100n  [cap0603]
C23  10u  [CAP 0805]
C34  1000u/25v  [CAP DIP 10*13]
C46  100n  [cap0603]
C48  100n  [cap0603]
C57  100n  [cap0603]
C59  10u  [CAP 0805]
C60  100n  [cap0603]
C61  1000u/25v  [CAP DIP 10*13]
C65  10u  [CAP 0805]
C66  100n  [cap0603]
C67  10u  [CAP 0805]
C68  100n  [cap0603]
C72  1000U  [cap  dip 10*20]
C73  1u  [cap0603]
C74  100n  [cap0603]
C75  1000u/25v  [CAP DIP 10*13]
C76  100n  [cap0603]
C77  100n  [cap0603]
C98  1000u/25v  [CAP DIP 10*13]
D1  1N5819(SOD123)  [1N5819 SOD-123]
D5  1N5819(SOD123)  [1N5819 SOD-123]
D7  1N5819(SOD123)  [1N5819 SOD-123]
J1  Power jack  [Power jack]
L8  Ferrite-0805  [Ferrite-0805]
L13  33uH, 8*7  [Inductor 8*7]
L16  33uH, 8*7  [Inductor 8*7]
R11  3.3k  [RES-0603]
R23  5.6k  [RES-0603]
R74  1k  [RES-0603]
R75  9.1k  [RES-0603]
SB1  jumper  [JP2_SMD]  (value not drawn)
U2  78L12  [78L05]
U3  XL1509-12E  [FR9886]
U4  78L05  [78L05]
U8  XL1509-12E  [FR9886]

### Ports
3.3V, 5V, 12V, 12V_FAN, GND, GROUND, VCC, Vout

### Nets
3.3V: C1.1 C61.1(POS) L13.1 R23.2 ; port 3.3V
5V: SB1.2 ; port 5V  [project net VPWR]
12V: C59.2 C60.2 L8.2 U2.1(OUT) ; port 12V
12V_FAN: C74.1 C98.1(POS) L16.1 R75.2 ; port 12V_FAN
GND_power: C23.1 C34.2(NEG) C46.1 C48.1 C57.1 C59.1 C60.1 C61.2(NEG) C65.1 C66.1 C67.1 C68.1 C72.2(NEG) C73.1 C75.2(NEG) C76.1 C77.1 C98.2(NEG) D5.2(C) D7.2(C) J1.2 J1.3 R11.1 R74.1 U2.2(COM) U3.4(EN) U3.5(GND) U3.6(GND) U3.7(GND) U3.8(GND) U4.2(COM) U8.4(EN) U8.5(GND) U8.6(GND) U8.7(GND) U8.8(GND) ; port GROUND, port GND  [project net GND]
VCC: D1.2(A) J1.1 ; port VCC
Vin-P: C65.2 C66.2 L8.1 U4.3(IN)
Vout: C67.2 C68.2 C72.1(POS) C73.2 SB1.1 U4.1(OUT) ; port Vout
NetC1_2: C1.2 R11.2 R23.1 U3.3(FB)
NetC23_2: C23.2 C34.1(POS) C46.2 C48.2 C57.2 C75.1(POS) C76.2 C77.2 D1.1(K) U2.3(IN) U3.1(VIN) U8.1(VIN)
NetC74_2: C74.2 R74.2 R75.1 U8.3(FB)
NetD5_1: D5.1(A) L13.2 U3.2(SW)
NetD7_1: D7.1(A) L16.2 U8.2(SW)

### Library data of the parts
C1 C46 C48 C57 C60 C66 C68 C73 C74 C76 C77 = Cap 0603: Capacitor 0603; Value: 104; Published: 8-Jun-2000; LatestRevisionDate: 17-Jul-2002; LatestRevisionNote: Re-released for DXP Platform.; Publisher: Altium Limited
C23 C59 C65 C67 = Cap 0805: Capacitor 0805; Value: 104; Published: 8-Jun-2000; LatestRevisionDate: 17-Jul-2002; LatestRevisionNote: Re-released for DXP Platform.; Publisher: Altium Limited
C34 C61 C75 C98 = capacitor dip 10*13: as C14 on sheet Amplifier; Package: Radial Nichicon; Value: *; Price: None; SnapEDA_Link: https://www.snapeda.com/parts/UVZ1H222MHD/Nichicon/view-part/468437/?ref=snap; Availability: Unavailable
C72 = capacitor dip 10*20: 2200ÂµF 50V Aluminum Electrolytic Capacitors Radial, Can 1000 Hrs @ 105Â°C; MF: Nichicon; MP: UVZ1H222MHD; Package: Radial Nichicon; Value: *; Price: None; SnapEDA_Link: https://www.snapeda.com/parts/UVZ1H222MHD/Nichicon/view-part/468437/?ref=snap; Availability: Unavailable
D1 D5 D7 = 1N5819(SOD123): Shotkey diod SOD-123; MP: BAS716; MF: Nexperia USA; SnapEDA_Link: https://www.snapeda.com/parts/BAS716/Nexperia%20USA%20Inc./view-part/143287/?ref=snap; Price: None; Package: SOD-523 NXP Semiconductors; Arrow_Electronics-Purchase-URL: https://snapeda.com/shop?store=Arrow+Electronics&id=143287; Value: *; Availability: Unavailable
J1 = Power jack: 2.0 x 6.5 mm, 2.5 A, Horizontal, Through Hole, Tapered Pins, Dc Power Jack Connector; MF: CUI Devices; MP: PJ-102A; CUI_purchase_URL: https://www.cuidevices.com/product/interconnect/connectors/dc-power-connectors/jacks/pj-102a?utm_source=snapeda.com&utm_medium=referral&utm_campaign=snapedaBOM; Price: None; SnapEDA_Link: https://www.snapeda.com/parts/PJ-102A/CUI%20Devices/view-part/55545/?ref=snap; Value: *; Availability: Unavailable; Package: None
L8 = Ferrite _0805: as L1 on sheet Amplifier; Package: 0603 Murata; Price: None; Availability: Unavailable; SnapEDA_Link: https://www.snapeda.com/parts/BLM18BB331SN1D/Murata%20Electronics%20North%20America/view-part/?ref=snap; Value: *
L13 L16 = INDUCTOR 8*7: Inductor round 8*7; MP: DR127-330-R; MF: Eaton; Price: None; Package: Nonstandard Eaton; Availability: Unavailable; SnapEDA_Link: https://www.snapeda.com/parts/DR127-330-R/Eaton/view-part/?ref=snap; Value: *
R11 R23 R74 R75 = Res 0603: Resistor 0603; Published: 8-Jun-2000; LatestRevisionDate: 29-May-2009; LatestRevisionNote: IPC-7351 Footprint Added.; PackageReference: J1-0603; Publisher: Altium Limited; PackageDescription: Chip Resistor
SB1 = jumper: Circuit Breaker; Solder: NO; Revision: July-2002: Re-released for DXP Platform.
U2 U4 = 78L05: Linear Voltage Regulator IC 1 Output 100mA SOT-89-3; MP: UA78L05CPK; MF: Texas Instruments; Availability: Unavailable; Package: SOT-89-3 Texas Instruments; SnapEDA_Link: https://www.snapeda.com/parts/UA78L05CPK/Texas%20Instruments/view-part/512891/?ref=snap; Value: *; Price: None
U3 U8 = XL1509-12E: Regulator SOP-8; Manufacturer_Name: Fitipower; Manufacturer_Part_Number: FR9886SOGTR; Datasheet Link: https://www.insidegadgets.com/wp-content/uploads/2015/03/FR9886.pdf; Height: 1.75mm

## Sheet Clock.SchDoc
size A2
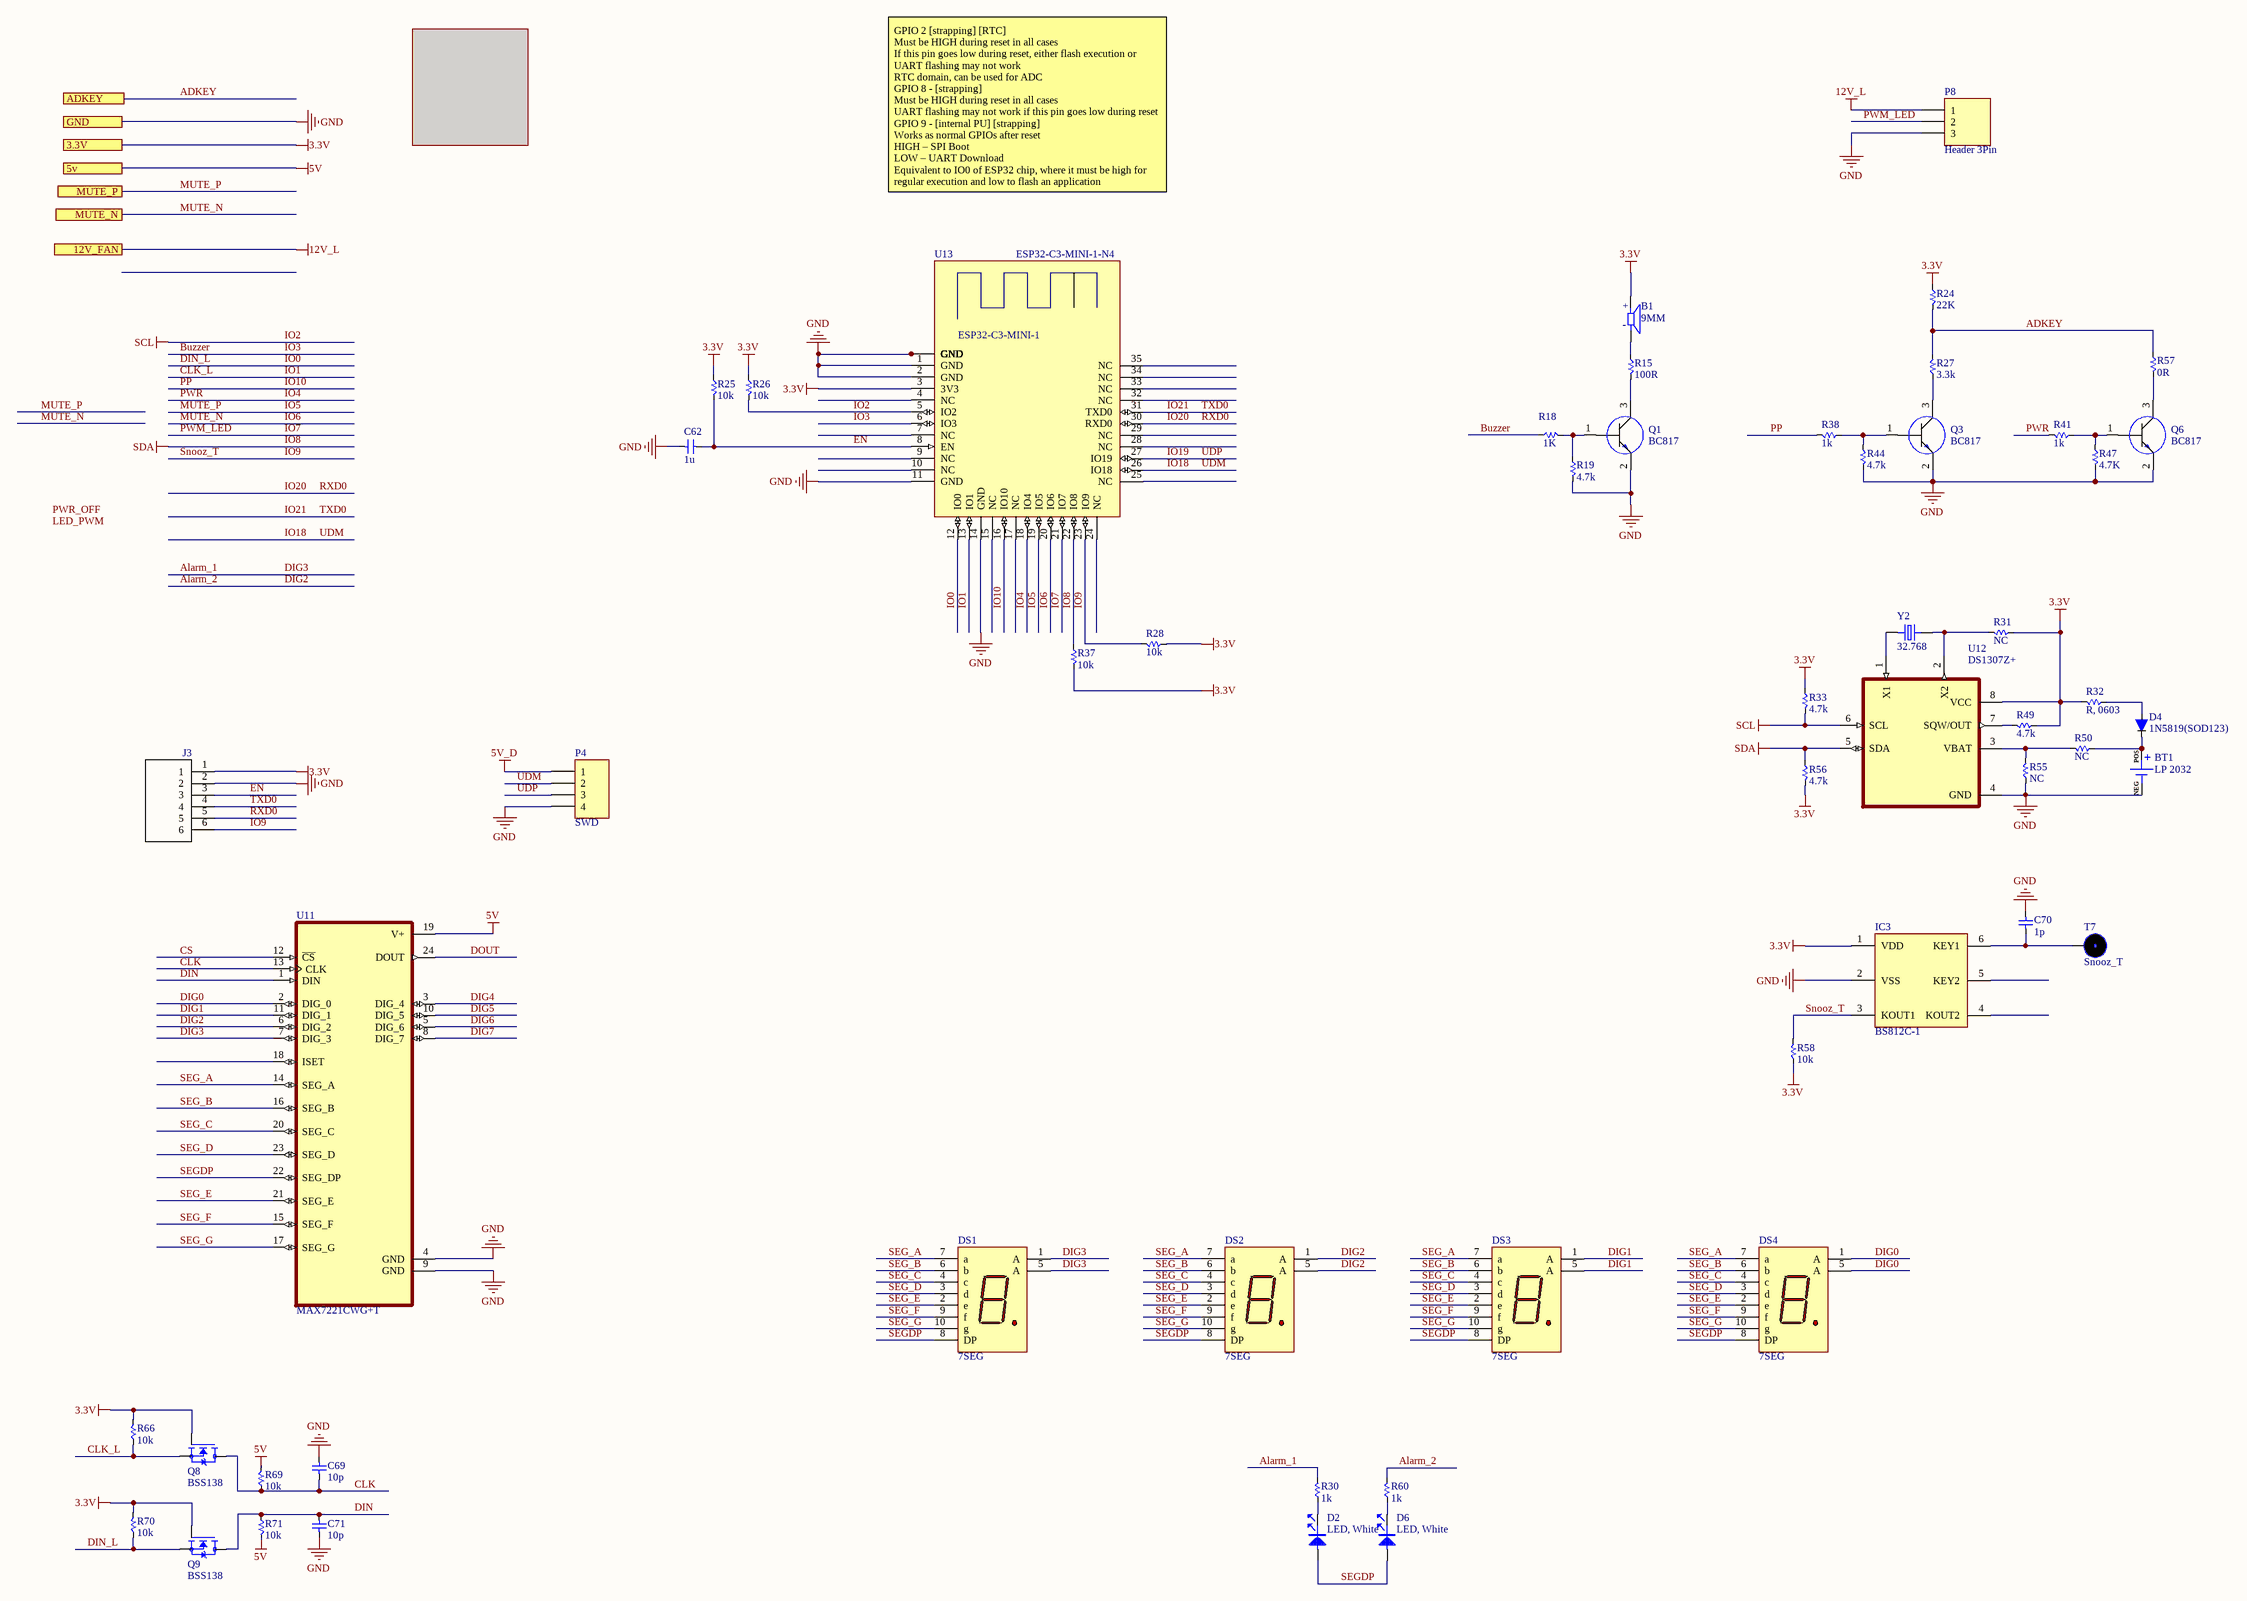
[diagram p7: Clock.SchDoc]

### Parts
(Parts that share a designator on the sheet are numbered #1, #2 ... from top to bottom, then left to right.)
B1  9MM  [Buzzer-TMB09A05]
BT1  LP 2032  [battery Holder 2032]
C62#2  1u  [cap0603]
C69  10p  [cap0603]
C70  1p  [cap0603]
C71  10p  [cap0603]
D2  LED, White  [LED 1206]
D4  1N5819(SOD123)  [1N5819 SOD-123]
D6  LED, White  [LED 1206]
DS1  7SEG  [7Seg 90*60 - No Wiring COMMON Cathod - 1206]
DS2  7SEG  [7Seg 90*60 - No Wiring COMMON Cathod - 1206]
DS3  7SEG  [7Seg 90*60 - No Wiring COMMON Cathod - 1206]
DS4  7SEG  [7Seg 90*60 - No Wiring COMMON Cathod - 1206]
IC3  BS812C-1  [BS812C-1]
J3  NC  [pin header1*6]  (value not drawn)
P4  SWD  [HDR1X4H]
P8  Header 3Pin  [CONN-PHOENIX-3.81 3Pin]
Q1  BC817  [BJT SS805]
Q3  BC817  [BJT SS805]
Q6  BC817  [BJT SS805]
Q8  BSS138  [BSS138]
Q9  BSS138  [BSS138]
R15  100R  [RES-0603]
R18  1K  [RES-0603]
R19  4.7k  [RES-0603]
R24  22K  [RES-0603]
R25  10k  [RES-0603]
R26  10k  [RES-0603]
R27  3.3k  [RES-0603]
R28  10k  [RES-0603]
R30  1k  [RES-0603]
R31#2  NC  [RES-0603]
R32  R, 0603  [RES-0603]
R33#2  4.7k  [RES-0603]
R37  10k  [RES-0603]
R38  1k  [RES-0603]
R41  1k  [RES-0603]
R44  4.7k  [RES-0603]
R47  4.7K  [RES-0603]
R49  4.7k  [RES-0603]
R50  NC  [RES-0603]
R55  NC  [RES-0603]
R56  4.7k  [RES-0603]
R57  0R  [RES-0603]
R58  10k  [RES-0603]
R60  1k  [RES-0603]
R66  10k  [RES-0603]
R69  10k  [RES-0603]
R70  10k  [RES-0603]
R71  10k  [RES-0603]
T7  Snooz_T  [Touch pad CIRCULE - 5mm]
U11  MAX7221CWG+T  [MAX7221CWG]
U12  DS1307Z+  [DS1307]
U13  ESP32-C3-MINI-1-N4  [ESP32-C3-MINI-1]
Y2  32.768  [Crystal_AB38T-32.768KHZ]

### Ports
3.3V, 5v, 12V_FAN, ADKEY, GND, MUTE_N, MUTE_P

### Nets
3.3V: B1.P IC3.1(VDD) J3.1 Q8.1(G) Q9.1(G) R24.1 R25.1 R26.1 R28.1 R31#2.1 R32.2 R33#2.1 R37.2 R49.1 R56.2 R58.1 R66.2 R70.2 U12.8(VCC) U13.3(3V3) ; port 3.3V
5V: R69.2 R71.2 U11.19(V+) ; port 5v  [project net VPWR]
5V_D: P4.1
12V_L: P8.1 ; port 12V_FAN  [project net 12V_FAN]
GND: BT1.NEG C62#2.1 C69.1 C70.2 C71.2 IC3.2(VSS) J3.2 P4.4 P8.3 Q1.2(E) Q3.2(E) Q6.2(E) R19.2 R44.2 R47.2 R55.1 U11.4(GND) U11.9(GND) U12.4(GND) U13.1(GND) U13.2(GND) U13.11(GND) U13.14(GND) U13.36(GND) U13.37(GND) U13.38(GND) U13.39(GND) U13.40(GND) U13.41(GND) U13.42(GND) U13.43(GND) U13.44(GND) U13.45(GND) U13.46(GND) U13.47(GND) U13.48(GND) U13.49_1(GND) U13.49_2(GND) U13.49_3(GND) U13.49_4(GND) U13.49_5(GND) U13.49_6(GND) U13.49_7(GND) U13.49_8(GND) U13.49_9(GND) U13.50(GND) U13.51(GND) U13.52(GND) U13.53(GND) ; port GND
IO2: R26.2 R33#2.2 U12.6(SCL) U13.5(IO2)  [also labelled SCL]
IO8: R37.1 R56.1 U12.5(SDA) U13.22(IO8)  [also labelled SDA]
ADKEY: R24.2 R27.2 R57.1 ; port ADKEY
Alarm_1: DS1.1(A) DS1.5(A) R30.2 U11.7(DIG_3)  [also labelled DIG3]
Alarm_2: DS2.1(A) DS2.5(A) R60.2 U11.6(DIG_2)  [also labelled DIG2]
Buzzer: R18.1 U13.6(IO3)  [also labelled IO3]
CLK: C69.2 Q8.3(D) R69.1 U11.13(CLK)
CLK_L: Q8.2(S) R66.1 U13.13(IO1)  [also labelled IO1]
CS: U11.12(~{CS})
DIG0: DS4.1(A) DS4.5(A) U11.2(DIG_0)
DIG1: DS3.1(A) DS3.5(A) U11.11(DIG_1)
DIG4: U11.3(DIG_4)
DIG5: U11.10(DIG_5)
DIG6: U11.5(DIG_6)
DIG7: U11.8(DIG_7)
DIN: C71.1 Q9.3(D) R71.1 U11.1(DIN)
DIN_L: Q9.2(S) R70.1 U13.12(IO0)  [also labelled IO0]
DOUT: U11.24(DOUT)
EN: C62#2.2 J3.3 R25.2 U13.8(EN)
IO4: R41.2 U13.18(IO4)  [also labelled PWR]
IO5: U13.19(IO5) ; port MUTE_P  [also labelled MUTE_P]  [project net CTRL_P]
IO6: U13.20(IO6) ; port MUTE_N  [also labelled MUTE_N]  [project net CTRL]
IO7: P8.2 U13.21(IO7)  [also labelled PWM_LED]
IO9: IC3.3(KOUT1) J3.6 R28.2 R58.2 U13.23(IO9)  [also labelled Snooz_T]
IO10: R38.2 U13.16(IO10)  [also labelled PP]
IO18: P4.2 U13.26(IO18)  [also labelled UDM]
IO19: P4.3 U13.27(IO19)  [also labelled UDP]
IO20: J3.5 U13.30(RXD0)  [also labelled RXD0]
IO21: J3.4 U13.31(TXD0)  [also labelled TXD0]
SEG_A: DS1.7(a) DS2.7(a) DS3.7(a) DS4.7(a) U11.14(SEG_A)
SEG_B: DS1.6(b) DS2.6(b) DS3.6(b) DS4.6(b) U11.16(SEG_B)
SEG_C: DS1.4(c) DS2.4(c) DS3.4(c) DS4.4(c) U11.20(SEG_C)
SEG_D: DS1.3(d) DS2.3(d) DS3.3(d) DS4.3(d) U11.23(SEG_D)
SEG_E: DS1.2(e) DS2.2(e) DS3.2(e) DS4.2(e) U11.21(SEG_E)
SEG_F: DS1.9(f) DS2.9(f) DS3.9(f) DS4.9(f) U11.15(SEG_F)
SEG_G: DS1.10(g) DS2.10(g) DS3.10(g) DS4.10(g) U11.17(SEG_G)
SEGDP: D2.2 D6.2 DS1.8(DP) DS2.8(DP) DS3.8(DP) DS4.8(DP) U11.22(SEG_DP)
NetB1_N: B1.N R15.1
NetBT1_POS: BT1.POS D4.1(A) R50.1
NetC70_1: C70.1 IC3.6(KEY1) T7.1
NetD2_1: D2.1 R30.1
NetD4_2: D4.2(C) R32.1
NetD6_1: D6.1 R60.1
NetQ1_1: Q1.1(B) R18.2 R19.1
NetQ1_3: Q1.3(C) R15.2
NetQ3_1: Q3.1(B) R38.1 R44.1
NetQ3_3: Q3.3(C) R27.1
NetQ6_1: Q6.1(B) R41.1 R47.1
NetQ6_3: Q6.3(C) R57.2
NetR31#2_2: R31#2.2 U12.2(X2) Y2.2
NetR49_2: R49.2 U12.7(SQW/OUT)
NetR50_2: R50.2 R55.2 U12.3(VBAT)
NetU12_1: U12.1(X1) Y2.1

Not connected (* = marked no-connect by the designer): IC3 4(KOUT2) 5(KEY2); U11 18(ISET); U13 4(NC) 7(NC) 9(NC) 10(NC) 15(NC) 17(NC) 24(NC) 25(NC) 28(NC) 29(NC) 32(NC) 33(NC) 34(NC) 35(NC)

### Notes on the sheet
- GPIO 2 [strapping] [RTC]
  Must be HIGH during reset in all cases
  If this pin goes low during reset, either flash execution or UART flashing may not work
  RTC domain, can be used for ADC
  GPIO 8 - [strapping]
  Must be HIGH during reset in all cases
  UART flashing may not work if this pin goes low during reset
  GPIO 9 - [internal PU] [strapping]
  Works as normal GPIOs after reset
  HIGH – SPI Boot
  LOW – UART Download
  Equivalent to IO0 of ESP32 chip, where it must be high for regular execution and low to flash an application
- Labels drawn without touching a wire or pin: LED_PWM, PWR_OFF
- (in symbol Buzzer_9MM) +; -
- (in symbol ESP32-C3-MINI-1-N4) ESP32-C3-MINI-1

### Library data of the parts
B1 = Buzzer_9MM: 09 mm, 5 V, 85 dB, Through Hole, Magnetic Audio Transducer Buzzer; MF: CUI Devices; MP: CEM-1203(42); Package: None; Price: None; Check_prices: https://www.snapeda.com/parts/CEM-1203(42)/CUI+Devices/view-part/?ref=eda; Value: *; CUI_purchase_URL: https://www.cuidevices.com/product/audio/buzzers/audio-transducers/cem-1203(42)?utm_source=snapeda.com&utm_medium=referral&utm_campaign=snapedaBOM; SnapEDA_Link: https://www.snapeda.com/parts/CEM-1203(42)/CUI+Devices/view-part/?ref=snap; Availability: In Stock; Purchase-URL: https://pricing.snapeda.com/search/part/CEM-1203(42)/?ref=eda
BT1 = Battery Holder 2032: Battery Holder (Open) Coin, 20.0mm 1 Cell SMD (SMT) Tab; MP: LP2032SM-JJ-GTR; MF: MPD; DigiKey-Purchase-URL: https://snapeda.com/shop?store=DigiKey&id=288457; Value: *; Package: Non-Standard MPD; Price: None; SnapEDA_Link: https://www.snapeda.com/parts/LP2032SM-JJ-GTR/MPD%20(Memory%20Protection%20Devices)/view-part/288457/?ref=snap; Availability: Warning
C62#2 C69-C71 = Cap 0603: Capacitor 0603; Value: 104; Published: 8-Jun-2000; LatestRevisionDate: 17-Jul-2002; LatestRevisionNote: Re-released for DXP Platform.; Publisher: Altium Limited
D2 D6 = LED_red 1206: LED, red, 1206; Manuf_1: everlight; Manuf_Part_1: 19-213-R6C-AP1Q2B/3T; ECCN_US/EU: EAR99/NEC; Order: 19-213-R6C-AP1Q2B/3T
D4 = 1N5819(SOD123): as D1 on sheet POWER; SnapEDA_Link: https://www.snapeda.com/parts/BAS716/Nexperia%20USA%20Inc./view-part/143287/?ref=snap; Price: None; Package: SOD-523 NXP Semiconductors; Arrow_Electronics-Purchase-URL: https://snapeda.com/shop?store=Arrow+Electronics&id=143287; Value: *; Availability: Unavailable
DS1-DS4 = 7SEG 90*60mm: 7-Segment Display 90*60mm; LED_Colour: As AlInGaP Red; Published: 26-May-2004; LatestRevisionDate: 11-Oct-2004; LatestRevisionNote: Display outline superimposed on PCB Footprint.; DatasheetDocument: 20-Nov-2001; PackageDocument: 01-Oct-2001; PackageReference: Case-5; Publisher: Altium Limited; ComponentLink1Description: Manufacturer Link; ComponentLink1URL: http://www.agilent.com/; ComponentLink2Description: Datasheet; ComponentLink2URL: http://cp.literature.agilent.com/litweb/pdf/5988-4823EN.pdf
IC3 = BS812C-1: Integrated Circuit; Manufacturer_Name: Holtek; Manufacturer_Part_Number: BS814A-1; Datasheet Link: https://www.holtek.com/documents/10179/116711/BS81xA-xv150.pdf; Height: 1.1mm
J3 = pin header 06: Pin Connector 06 MODII HDR SRST B/A .100CL 6 POS; MF: TE Connectivity; MP: 5-146283-6; Price: None; SnapEDA_Link: https://www.snapeda.com/parts/5-146283-6/TE%20Connectivity%20AMP%20Connectors/view-part/?ref=snap; Availability: Unavailable; TE_purchase_URL: https://www.te.com/usa-en/product-5-146283-6.html?te_bu=Cor&te_type=disp&te_campaign=seda_glo_cor-seda-global-disp-prtnr-fy19-seda-model-bom-cta_sma-317_1&elqCampaignId=32493; Package: None; Value: *
P4 = pin header 1X4: Header, 4-Pin; LatestRevisionDate: 17-Jul-2002; LatestRevisionNote: Re-released for DXP Platform.; Publisher: Altium Limited
P8 = CONN-Phoenix-3.81 3Pin: Phoenix Connector 3.81; LatestRevisionDate: 17-Jul-2002; LatestRevisionNote: Re-released for DXP Platform.; Publisher: Altium Limited
Q1 Q3 Q6 = SS8050-G BJT_ Transistor: Bipolar _BJT_ Transistor NPN 25V 1.5A 100MHz 300mW Surface Mount SOT-23; MF: Comchip Technology; SnapEDA_Link: https://www.snapeda.com/parts/SS8050-G/Comchip%20Technology/view-part/809142/?ref=snap; Price: None; MP: SS8050-G; Package: TO-236 Comchip; Availability: Unavailable; Value: *
R15 R18 R19 R24-R28 R30 R31#2 R32 R33#2 R37 R38 R41 R44 R47 R49 R50 R55-R58 R60 R66 R69-R71 = Res 0603: Resistor 0603; Published: 8-Jun-2000; LatestRevisionDate: 29-May-2009; LatestRevisionNote: IPC-7351 Footprint Added.; PackageReference: J1-0603; Publisher: Altium Limited; PackageDescription: Chip Resistor
  R18 R19 R24-R27 R38 R41 R44 R47 R57 R58: Value: *
T7 = touch pad 5mm
U11 = MAX7221CWG+T: LED Driver 64 Segment 330000uA Supply Current 24-Pin SOIC W T/R; MF: Maxim Integrated Products; MP: MAX7221CWG+T; Purchase-URL: https://pricing.snapeda.com/search/part/MAX7221CWG+T/?ref=eda; SnapEDA_Link: https://www.snapeda.com/parts/MAX7221CWG+T/Maxim+Integrated/view-part/?ref=snap; Price: None; Package: None; Value: *; Check_prices: https://www.snapeda.com/parts/MAX7221CWG+T/Maxim+Integrated/view-part/?ref=eda; Availability: In Stock
U12 = DS1307Z+: Real Time Clock _RTC_ IC Clock/Calendar 56B IÂ²C, 2-Wire Serial 8-SOIC _0.154, 3.90mm Width_; MF: Maxim Integrated; Availability: Unavailable; SnapEDA_Link: https://www.snapeda.com/parts/DS1307Z/Maxim%20Integrated/view-part/524266/?ref=snap; Price: None; Package: SO-8 Maxim Integrated; MP: DS1307Z; Value: *
U13 = ESP32-C3-MINI-1-N4: MF: {'manufacturer': u'Espressif Systems'}; Package: None; Price: None; Value: *; MP: ESP32-C3-MINI-1-N4; Availability: Unavailable
Y2 = Crystal 32.768KHz: 32.768 KHz Dip ±20ppm 12.5pf; MP: ECS-130-20-3X-TR; MF: ECS Inc.; Value: *; SnapEDA_Link: https://www.snapeda.com/parts/ECS-130-20-3X-TR/ECS%20Inc./view-part/2459108/?ref=snap; Check_prices: https://www.snapeda.com/parts/ECS-130-20-3X-TR/ECS%20Inc./view-part/2459108/?ref=eda; Purchase-URL: https://pricing.snapeda.com/search/part/ECS-130-20-3X-TR/?ref=eda; Availability: Warning; Price: None; Package: HC49/US ECS International

## Nets that join several sheets
3.3V: POWER (C1.1 C61.1 L13.1 R23.2), Clock (20 pins)
12V: Amplifier (C7.2 C9.1 IC2.8 R8.2), POWER (C59.2 C60.2 L8.2 U2.1)
12V_FAN: Amplifier (R16.2 R62.2 U6.1 U9.5), POWER (C74.1 C98.1 L16.1 R75.2), Clock (P8.1)
AGND: Amplifier (15 pins), Bluetooth (C29.2 U1.31)
GND: Amplifier (52 pins), Bluetooth (15 pins), POWER (36 pins), Clock (49 pins)
VCC: Amplifier (24 pins), POWER (D1.2 J1.1)
VPWR: Bluetooth (6 pins), POWER (SB1.2), Clock (R69.2 R71.2 U11.19)
ADKEY: Bluetooth (U1.15), Clock (R24.2 R27.2 R57.1)
CTRL: Amplifier (5 pins), Clock (U13.20)
CTRL_P: Amplifier (U14.2), Clock (U13.19)
DACL: Amplifier (R6.2 R34.2 R48.2), Bluetooth (U1.2)
DACR: Amplifier (R29.2 R36.1 R42.2), Bluetooth (U1.1)
MUTE: Amplifier (R4.1), Bluetooth (U1.13)